# EAGLE design qo-100-lora-transceiver (EAGLE 9.6.1)
CREVISION: 2; DESIGNER: Joao Silva

## Sheet 1 of 3: MCU
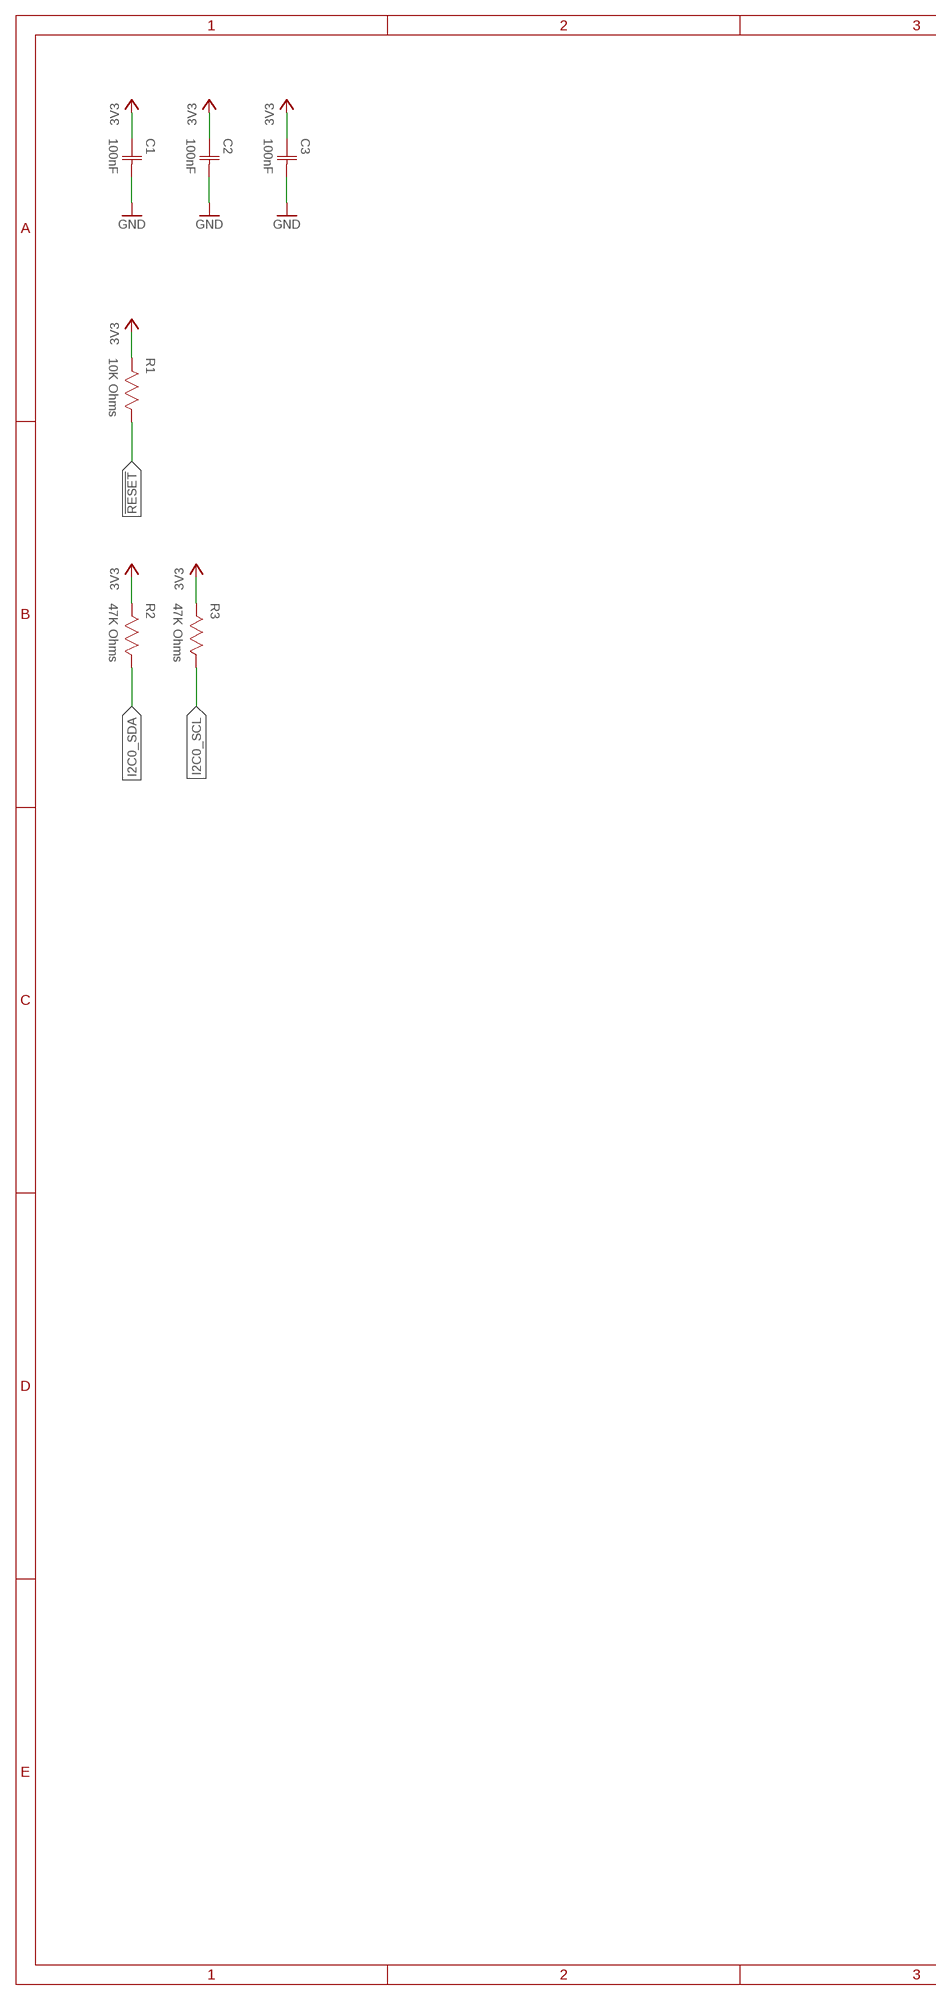
[diagram p0: schematic, sheet 1, part 1 of 2]
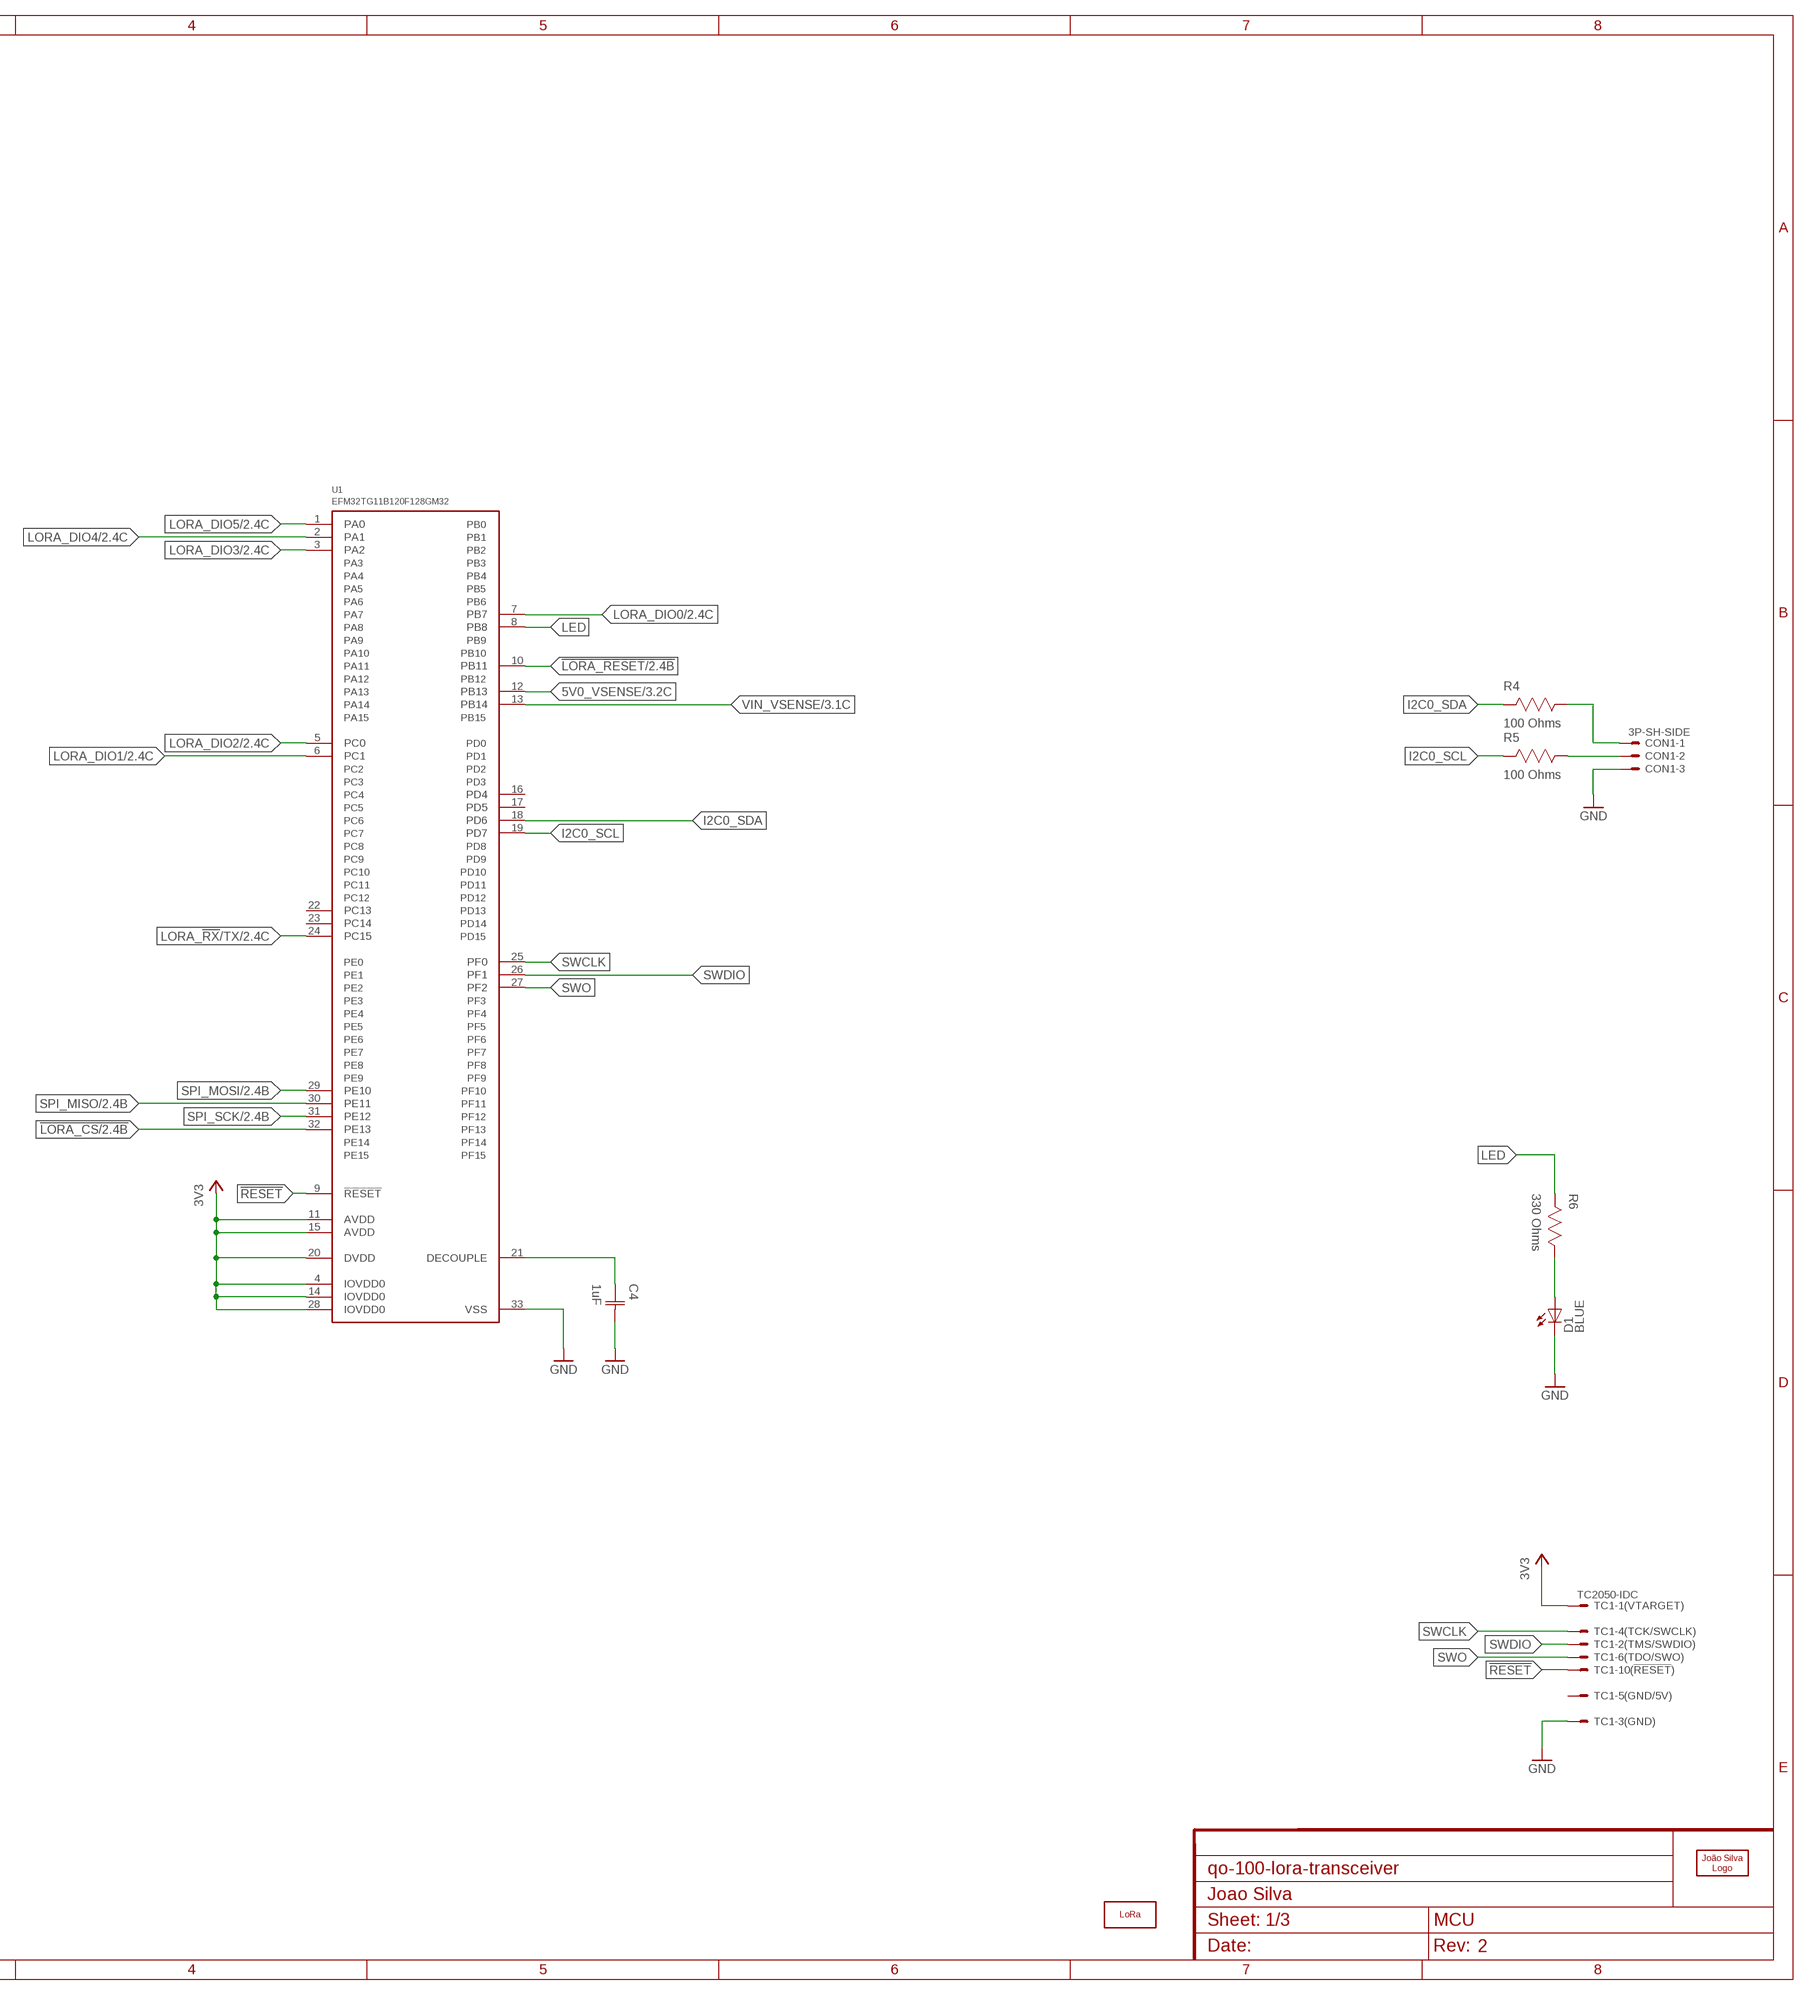
[diagram p1: schematic, sheet 1, part 2 of 2]

### Parts
C1  100nF  CAPACITOR-0603  [CAP0603]
C2  100nF  CAPACITOR-0603  [CAP0603]
C3  100nF  CAPACITOR-0603  [CAP0603]
C4  1uF  CAPACITOR-0603  [CAP0603]
CON1  3P-SH-SIDE  [SH-03-SIDE]
D1  LED0603  [0603]
LOGO1  LORA-10MM  [LORA_10MM]
LOGO2  JS-10MM  [JS_10MM]
R1  10K Ohms  RESISTOR-0603  [RES0603]
R2  47K Ohms  RESISTOR-0603  [RES0603]
R3  47K Ohms  RESISTOR-0603  [RES0603]
R4  100 Ohms  RESISTOR-0603  [RES0603]
R5  100 Ohms  RESISTOR-0603  [RES0603]
R6  330 Ohms  RESISTOR-0603  [RES0603]
TC1  TC2050-IDC  [TC2050-IDC]
U1  EFM32TG11B120F128GM32  [QFN32_0.5P_TG]

### Nets
3V3: C1.1(C1) C2.1(C1) C3.1(C1) R1.2 R2.2 R3.2 TC1.1 U1.4(IOVDD0) U1.11(AVDD) U1.14(IOVDD0) U1.15(AVDD) U1.20(DVDD) U1.28(IOVDD0) ; also sheet 2,3
5V0_VSENSE: U1.12(PB13) ; also sheet 3
!LORA_CS: U1.32(PE13) ; also sheet 2
!LORA_RESET: U1.10(PB11) ; also sheet 2
!RESET: R1.1 TC1.10 U1.9(!RESET)
GND: C1.2(C2) C2.2(C2) C3.2(C2) C4.2(C2) CON1.3 D1.C TC1.3 U1.33(VSS) ; also sheet 2,3
I2C0_SCL: R3.1 R5.2 U1.19(PD7)
I2C0_SDA: R2.1 R4.2 U1.18(PD6)
LED: R6.2 U1.8(PB8)
LORA_!RX!/TX: U1.24(PC15) ; also sheet 2
LORA_DIO0: U1.7(PB7) ; also sheet 2
LORA_DIO1: U1.6(PC1) ; also sheet 2
LORA_DIO2: U1.5(PC0) ; also sheet 2
LORA_DIO3: U1.3(PA2) ; also sheet 2
LORA_DIO4: U1.2(PA1) ; also sheet 2
LORA_DIO5: U1.1(PA0) ; also sheet 2
N$4: CON1.2 R5.1
N$6: C4.1(C1) U1.21(DECOUPLE)
N$25: D1.A R6.1
N$38: CON1.1 R4.1
SPI_MISO: U1.30(PE11) ; also sheet 2
SPI_MOSI: U1.29(PE10) ; also sheet 2
SPI_SCK: U1.31(PE12) ; also sheet 2
SWCLK: TC1.4 U1.25(PF0)
SWDIO: TC1.2 U1.26(PF1)
SWO: TC1.6 U1.27(PF2)
VIN_VSENSE: U1.13(PB14) ; also sheet 3
Unconnected: TC1.5 TC1.7 TC1.8 TC1.9 U1.16(PD4) U1.17(PD5) U1.22(PC13) U1.23(PC14)

## Sheet 2 of 3: LoRa Transceiver
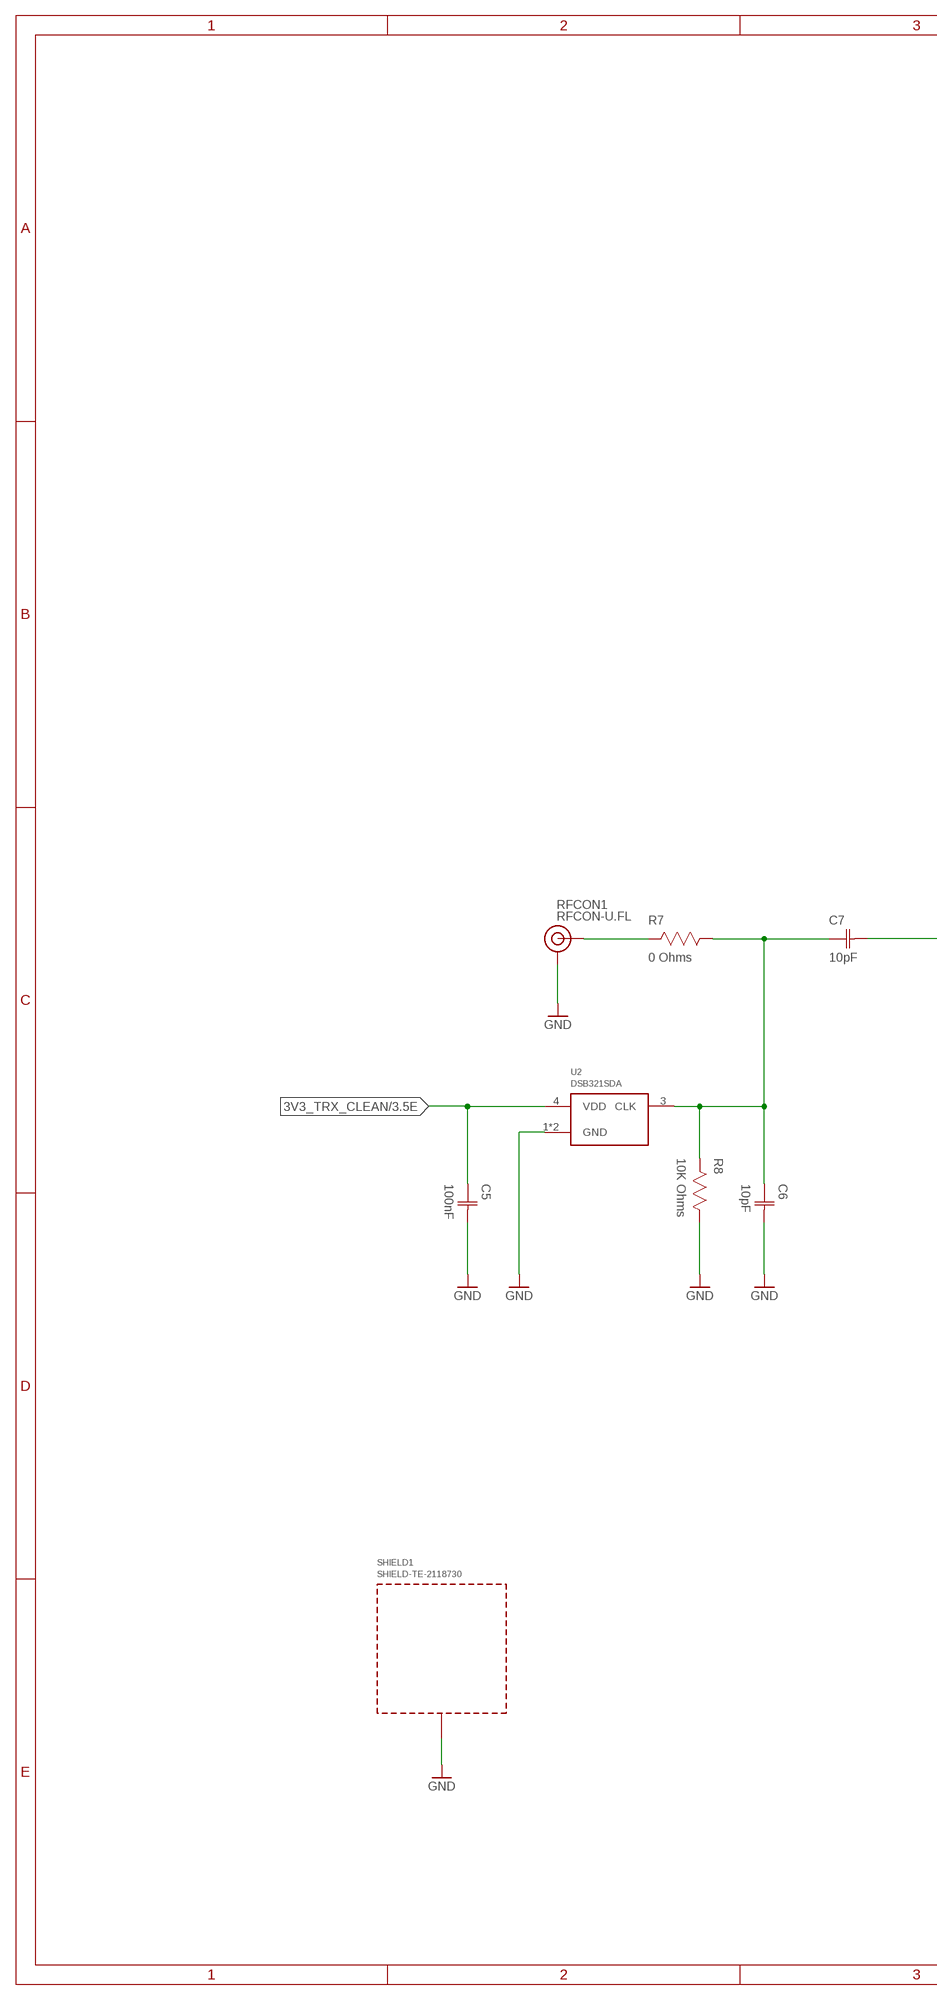
[diagram p2: schematic, sheet 2, part 1 of 2]
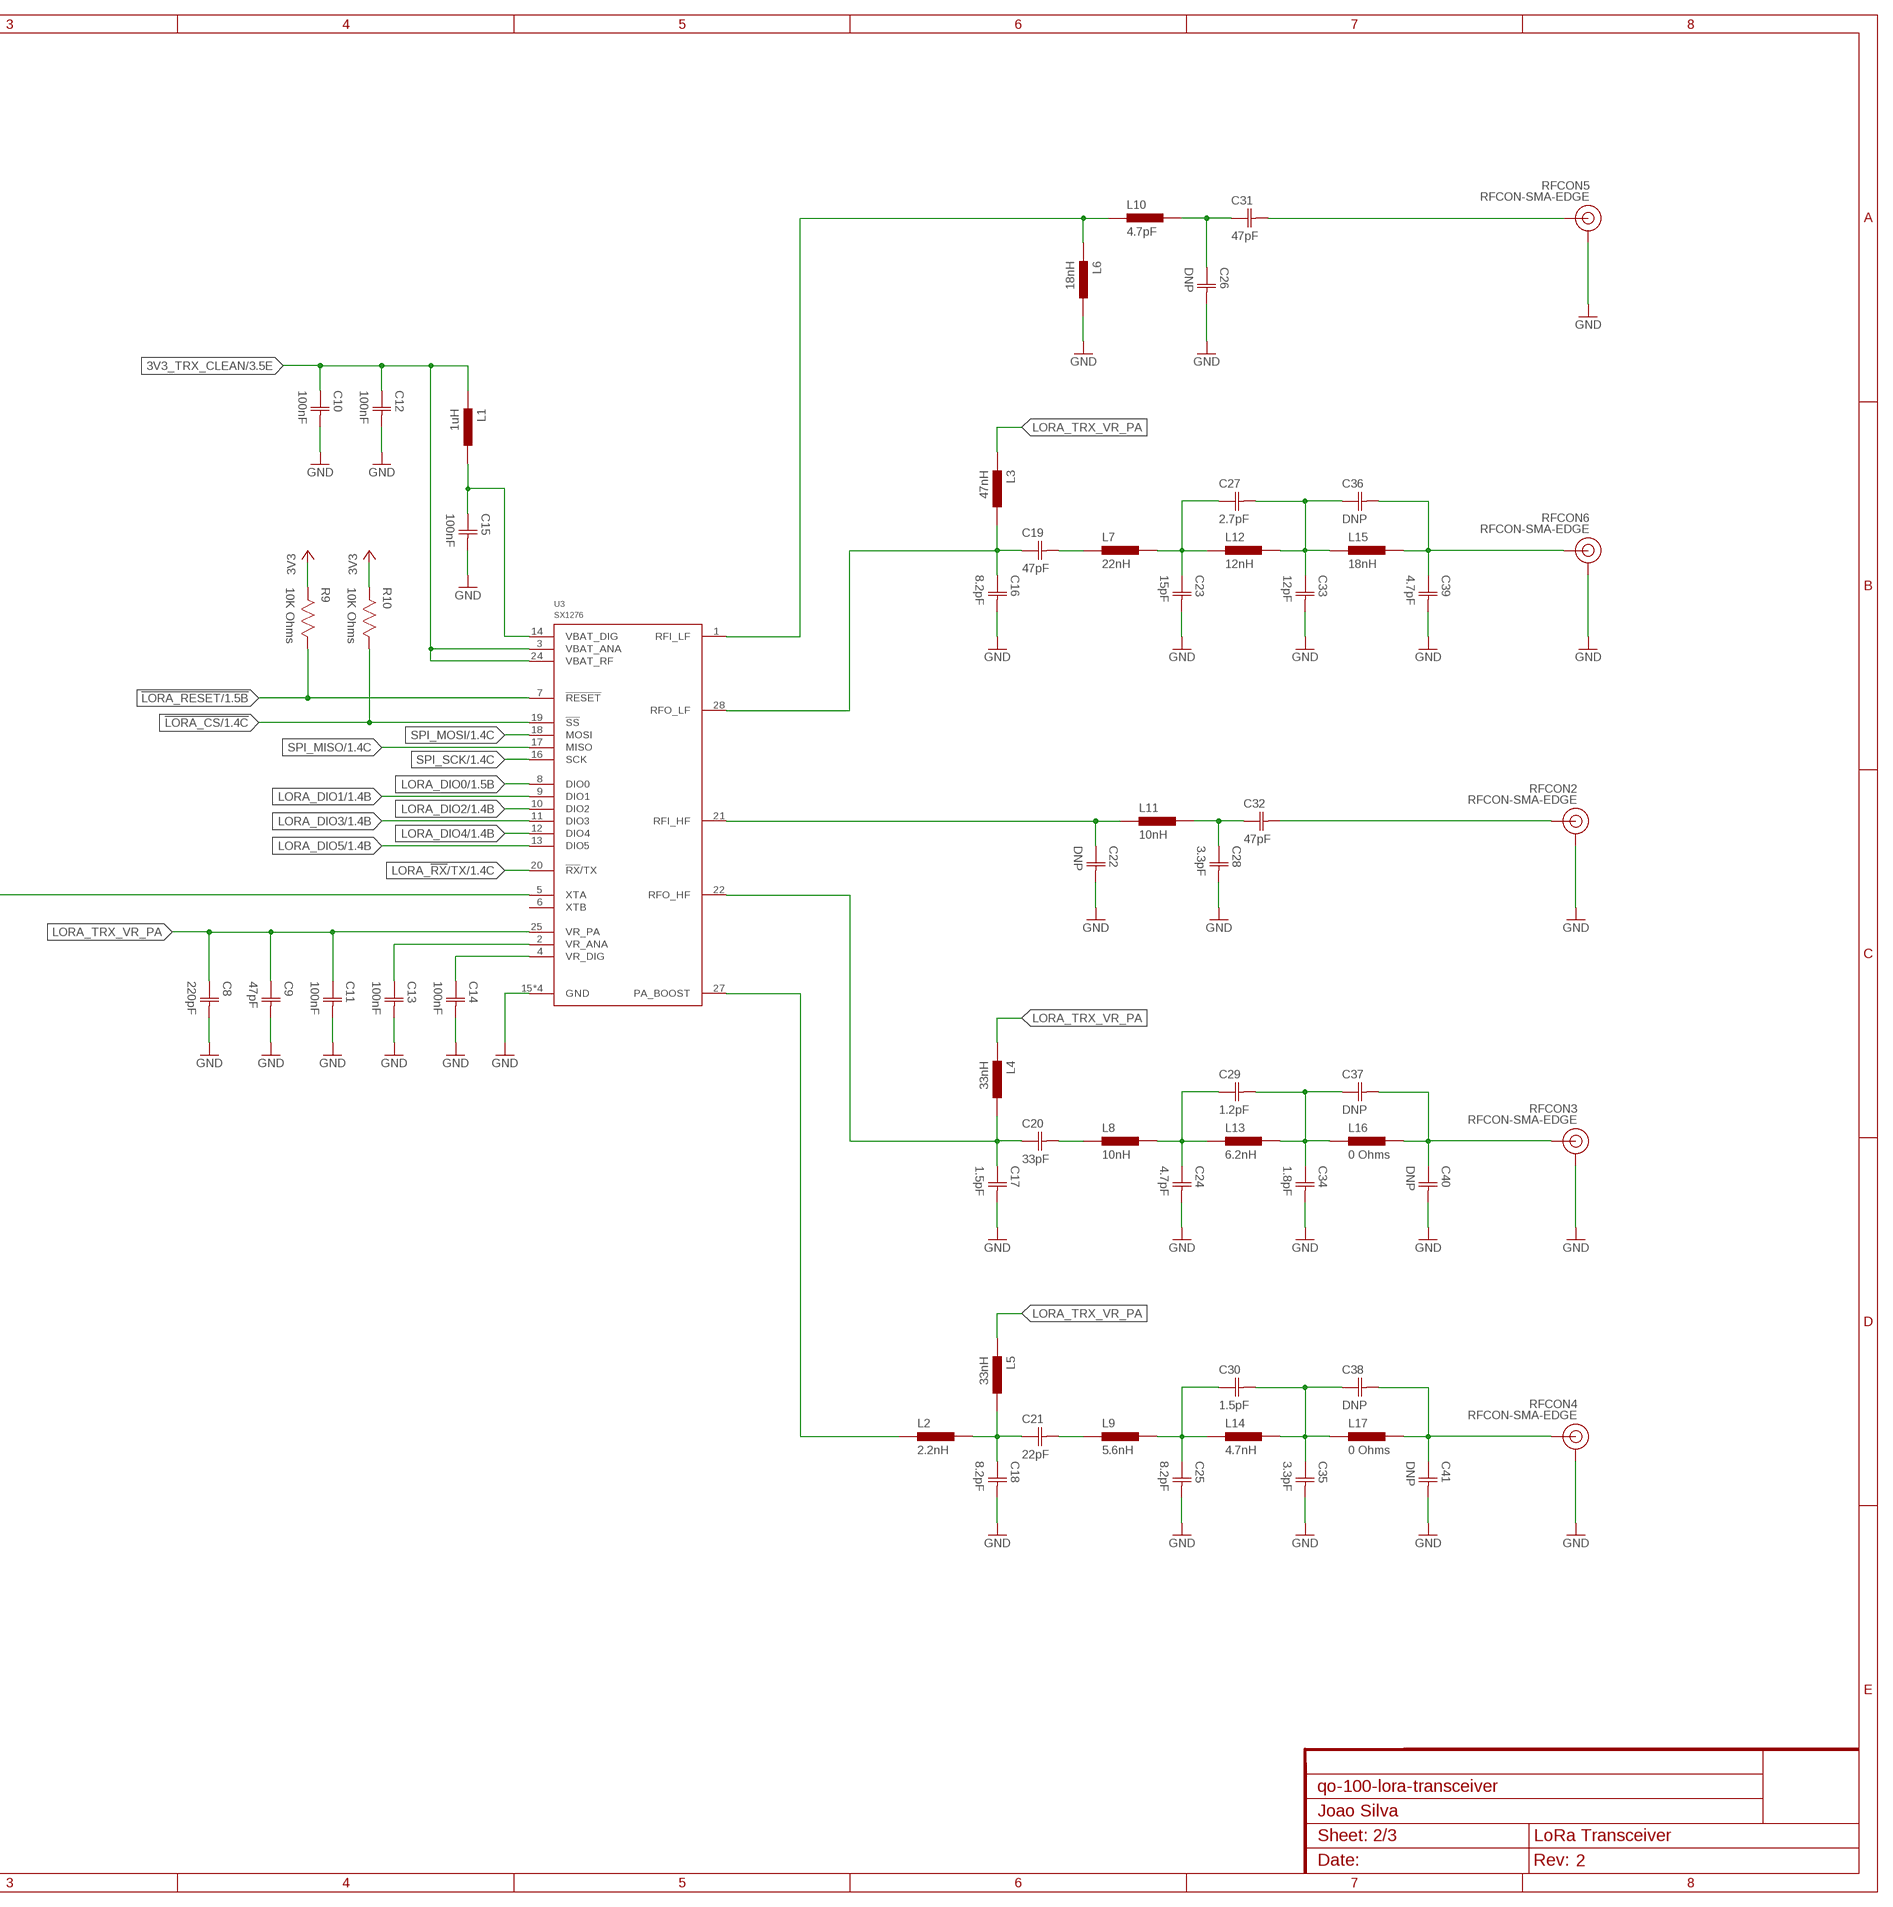
[diagram p3: schematic, sheet 2, part 2 of 2]

### Parts
C5  100nF  CAPACITOR-0603  [CAP0603]
C6  10pF  CAPACITOR-0603  [CAP0603]
C7  10pF  CAPACITOR-0603  [CAP0603]
C8  220pF  CAPACITOR-0603  [CAP0603]
C9  47pF  CAPACITOR-0603  [CAP0603]
C10  100nF  CAPACITOR-0603  [CAP0603]
C11  100nF  CAPACITOR-0603  [CAP0603]
C12  100nF  CAPACITOR-0603  [CAP0603]
C13  100nF  CAPACITOR-0603  [CAP0603]
C14  100nF  CAPACITOR-0603  [CAP0603]
C15  100nF  CAPACITOR-0603  [CAP0603]
C16  8.2pF  CAPACITOR-0603  [CAP0603]
C17  1.5pF  CAPACITOR-0603  [CAP0603]
C18  8.2pF  CAPACITOR-0603  [CAP0603]
C19  47pF  CAPACITOR-0603  [CAP0603]
C20  33pF  CAPACITOR-0603  [CAP0603]
C21  22pF  CAPACITOR-0603  [CAP0603]
C22  DNP  CAPACITOR-0603  [CAP0603]
C23  15pF  CAPACITOR-0603  [CAP0603]
C24  4.7pF  CAPACITOR-0603  [CAP0603]
C25  8.2pF  CAPACITOR-0603  [CAP0603]
C26  DNP  CAPACITOR-0603  [CAP0603]
C27  2.7pF  CAPACITOR-0603  [CAP0603]
C28  3.3pF  CAPACITOR-0603  [CAP0603]
C29  1.2pF  CAPACITOR-0603  [CAP0603]
C30  1.5pF  CAPACITOR-0603  [CAP0603]
C31  47pF  CAPACITOR-0603  [CAP0603]
C32  47pF  CAPACITOR-0603  [CAP0603]
C33  12pF  CAPACITOR-0603  [CAP0603]
C34  1.8pF  CAPACITOR-0603  [CAP0603]
C35  3.3pF  CAPACITOR-0603  [CAP0603]
C36  DNP  CAPACITOR-0603  [CAP0603]
C37  DNP  CAPACITOR-0603  [CAP0603]
C38  DNP  CAPACITOR-0603  [CAP0603]
C39  4.7pF  CAPACITOR-0603  [CAP0603]
C40  DNP  CAPACITOR-0603  [CAP0603]
C41  DNP  CAPACITOR-0603  [CAP0603]
L1  1uH  INDUCTOR-0603  [IND0603]
L2  2.2nH  INDUCTOR-0603  [IND0603]
L3  47nH  INDUCTOR-0603  [IND0603]
L4  33nH  INDUCTOR-0603  [IND0603]
L5  33nH  INDUCTOR-0603  [IND0603]
L6  18nH  INDUCTOR-0603  [IND0603]
L7  22nH  INDUCTOR-0603  [IND0603]
L8  10nH  INDUCTOR-0603  [IND0603]
L9  5.6nH  INDUCTOR-0603  [IND0603]
L10  4.7pF  INDUCTOR-0603  [IND0603]
L11  10nH  INDUCTOR-0603  [IND0603]
L12  12nH  INDUCTOR-0603  [IND0603]
L13  6.2nH  INDUCTOR-0603  [IND0603]
L14  4.7nH  INDUCTOR-0603  [IND0603]
L15  18nH  INDUCTOR-0603  [IND0603]
L16  0 Ohms  INDUCTOR-0603  [IND0603]
L17  0 Ohms  INDUCTOR-0603  [IND0603]
R7  0 Ohms  RESISTOR-0603  [RES0603]
R8  10K Ohms  RESISTOR-0603  [RES0603]
R9  10K Ohms  RESISTOR-0603  [RES0603]
R10  10K Ohms  RESISTOR-0603  [RES0603]
RFCON1  RFCON-U.FL  [U.FL]
RFCON2  RFCON-SMA-EDGE  [SMA-EDGE]
RFCON3  RFCON-SMA-EDGE  [SMA-EDGE]
RFCON4  RFCON-SMA-EDGE  [SMA-EDGE]
RFCON5  RFCON-SMA-EDGE  [SMA-EDGE]
RFCON6  RFCON-SMA-EDGE  [SMA-EDGE]
SHIELD1  SHIELD-TE-2118730  [2118730]
U2  DSB321SDA  [TCXO-3225]
U3  SX1276  [QFN28]

### Nets
3V3: R9.2 R10.2 ; also sheet 1,3
3V3_TRX_CLEAN: C5.1(C1) C10.1(C1) C12.1(C1) L1.1 U2.4(VDD) U3.3(VBAT_ANA) U3.24(VBAT_RF) ; also sheet 3
!LORA_CS: R10.1 U3.19(!SS) ; also sheet 1
!LORA_RESET: R9.1 U3.7(!RESET) ; also sheet 1
GND: C5.2(C2) C6.2(C2) C8.2(C2) C9.2(C2) C10.2(C2) C11.2(C2) C12.2(C2) C13.2(C2) C14.2(C2) C15.2(C2) C16.2(C2) C17.2(C2) C18.2(C2) C22.2(C2) C23.2(C2) C24.2(C2) C25.2(C2) C26.2(C2) C28.2(C2) C33.2(C2) C34.2(C2) C35.2(C2) C39.2(C2) C40.2(C2) C41.2(C2) L6.2 R8.1 RFCON1.P$1(GND) RFCON1.P$2(GND) RFCON2.GND@0(GND) RFCON2.GND@1(GND) RFCON2.GND@2(GND) RFCON2.GND@3(GND) RFCON3.GND@0(GND) RFCON3.GND@1(GND) RFCON3.GND@2(GND) RFCON3.GND@3(GND) RFCON4.GND@0(GND) RFCON4.GND@1(GND) RFCON4.GND@2(GND) RFCON4.GND@3(GND) RFCON5.GND@0(GND) RFCON5.GND@1(GND) RFCON5.GND@2(GND) RFCON5.GND@3(GND) RFCON6.GND@0(GND) RFCON6.GND@1(GND) RFCON6.GND@2(GND) RFCON6.GND@3(GND) SHIELD1.1(GND) SHIELD1.2(GND) SHIELD1.3(GND) SHIELD1.4(GND) SHIELD1.5(GND) SHIELD1.6(GND) SHIELD1.7(GND) SHIELD1.8(GND) SHIELD1.9(GND) SHIELD1.10(GND) SHIELD1.11(GND) SHIELD1.12(GND) SHIELD1.13(GND) SHIELD1.14(GND) SHIELD1.15(GND) SHIELD1.16(GND) SHIELD1.17(GND) SHIELD1.18(GND) SHIELD1.19(GND) SHIELD1.20(GND) SHIELD1.21(GND) SHIELD1.22(GND) SHIELD1.23(GND) SHIELD1.24(GND) SHIELD1.25(GND) SHIELD1.26(GND) SHIELD1.27(GND) SHIELD1.28(GND) U2.1(GND) U2.2(GND) U3.15(GND) U3.23(GND) U3.26(GND) U3.29(GND) ; also sheet 1,3
LORA_!RX!/TX: U3.20(!RX!/TX) ; also sheet 1
LORA_DIO0: U3.8(DIO0) ; also sheet 1
LORA_DIO1: U3.9(DIO1) ; also sheet 1
LORA_DIO2: U3.10(DIO2) ; also sheet 1
LORA_DIO3: U3.11(DIO3) ; also sheet 1
LORA_DIO4: U3.12(DIO4) ; also sheet 1
LORA_DIO5: U3.13(DIO5) ; also sheet 1
LORA_TRX_VR_ANA: C13.1(C1) U3.2(VR_ANA)
LORA_TRX_VR_DIG: C14.1(C1) U3.4(VR_DIG)
LORA_TRX_VR_PA: C8.1(C1) C9.1(C1) C11.1(C1) L3.1 L4.1 L5.1 U3.25(VR_PA)
N$1: C15.1(C1) L1.2 U3.14(VBAT_DIG)
N$2: C16.1(C1) C19.1(C1) L3.2 U3.28(RFO_LF)
N$3: C19.2(C2) L7.1
N$5: C23.1(C1) C27.1(C1) L7.2 L12.1
N$7: C27.2(C2) C33.1(C1) C36.1(C1) L12.2 L15.1
N$8: C22.1(C1) L11.1 U3.21(RFI_HF)
N$9: L6.1 L10.1 U3.1(RFI_LF)
N$10: C26.1(C1) C31.1(C1) L10.2
N$11: C17.1(C1) C20.1(C1) L4.2 U3.22(RFO_HF)
N$12: C20.2(C2) L8.1
N$13: C24.1(C1) C29.1(C1) L8.2 L13.1
N$14: C29.2(C2) C34.1(C1) C37.1(C1) L13.2 L16.1
N$15: C37.2(C2) C40.1(C1) L16.2 RFCON3.SIG(SIGNAL)
N$16: C28.1(C1) C32.1(C1) L11.2
N$17: L2.1 U3.27(PA_BOOST)
N$18: C18.1(C1) C21.1(C1) L2.2 L5.2
N$20: C36.2(C2) C39.1(C1) L15.2 RFCON6.SIG(SIGNAL)
N$21: C21.2(C2) L9.1
N$22: C25.1(C1) C30.1(C1) L9.2 L14.1
N$23: C30.2(C2) C35.1(C1) C38.1(C1) L14.2 L17.1
N$24: C38.2(C2) C41.1(C1) L17.2 RFCON4.SIG(SIGNAL)
N$26: C31.2(C2) RFCON5.SIG(SIGNAL)
N$27: C32.2(C2) RFCON2.SIG(SIGNAL)
N$28: C7.2(C2) U3.5(XTA)
N$29: R7.2 RFCON1.P$3(SIGNAL)
PLL_REF_DCC: C6.1(C1) C7.1(C1) R7.1 R8.2 U2.3(CLK)
SPI_MISO: U3.17(MISO) ; also sheet 1
SPI_MOSI: U3.18(MOSI) ; also sheet 1
SPI_SCK: U3.16(SCK) ; also sheet 1
Unconnected: U3.6(XTB)

## Sheet 3 of 3: Power
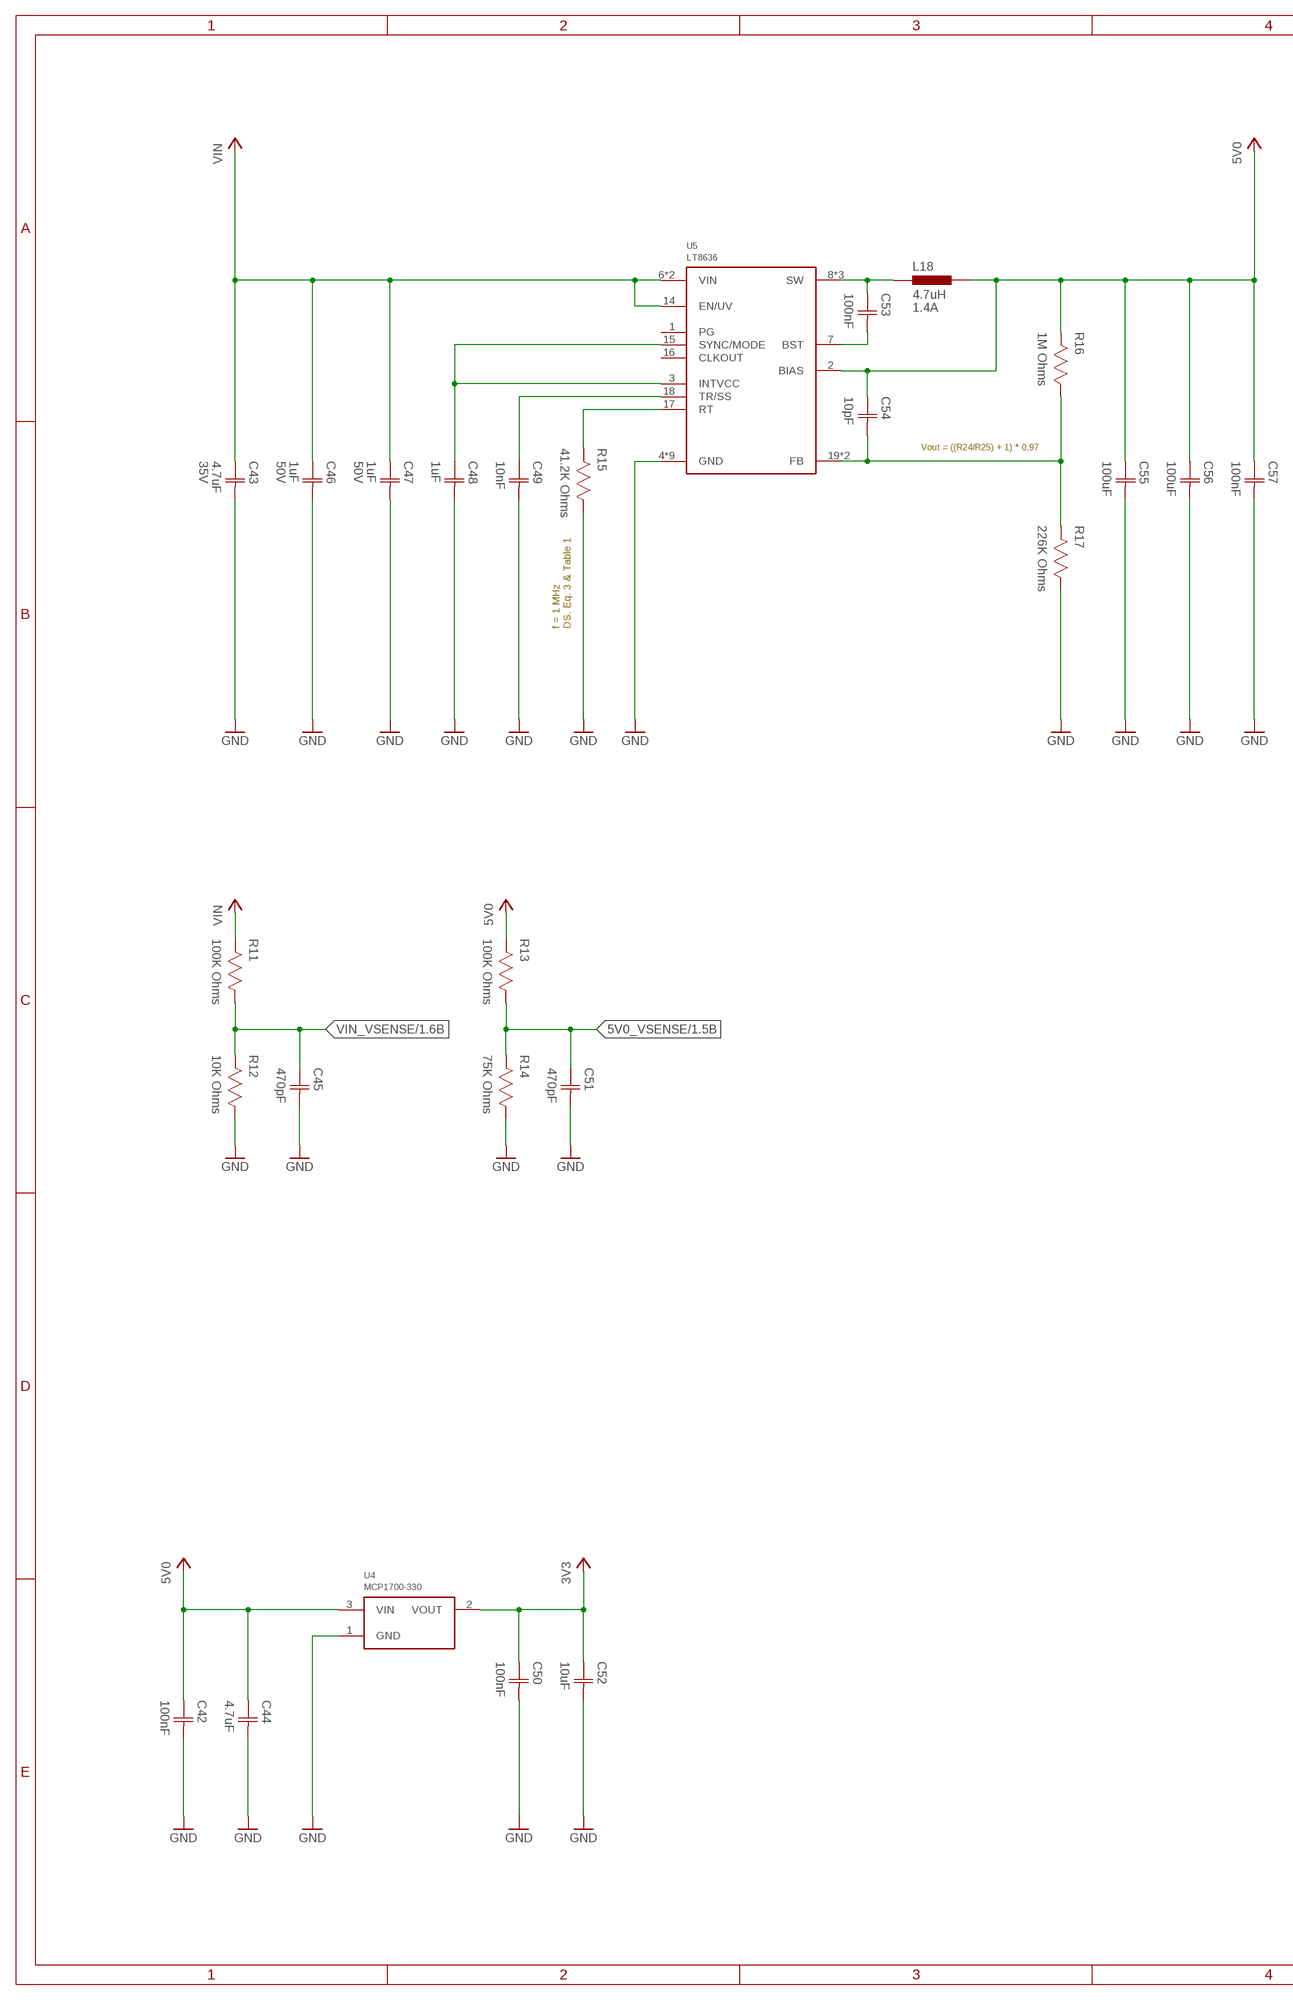
[diagram p4: schematic, sheet 3, part 1 of 2]
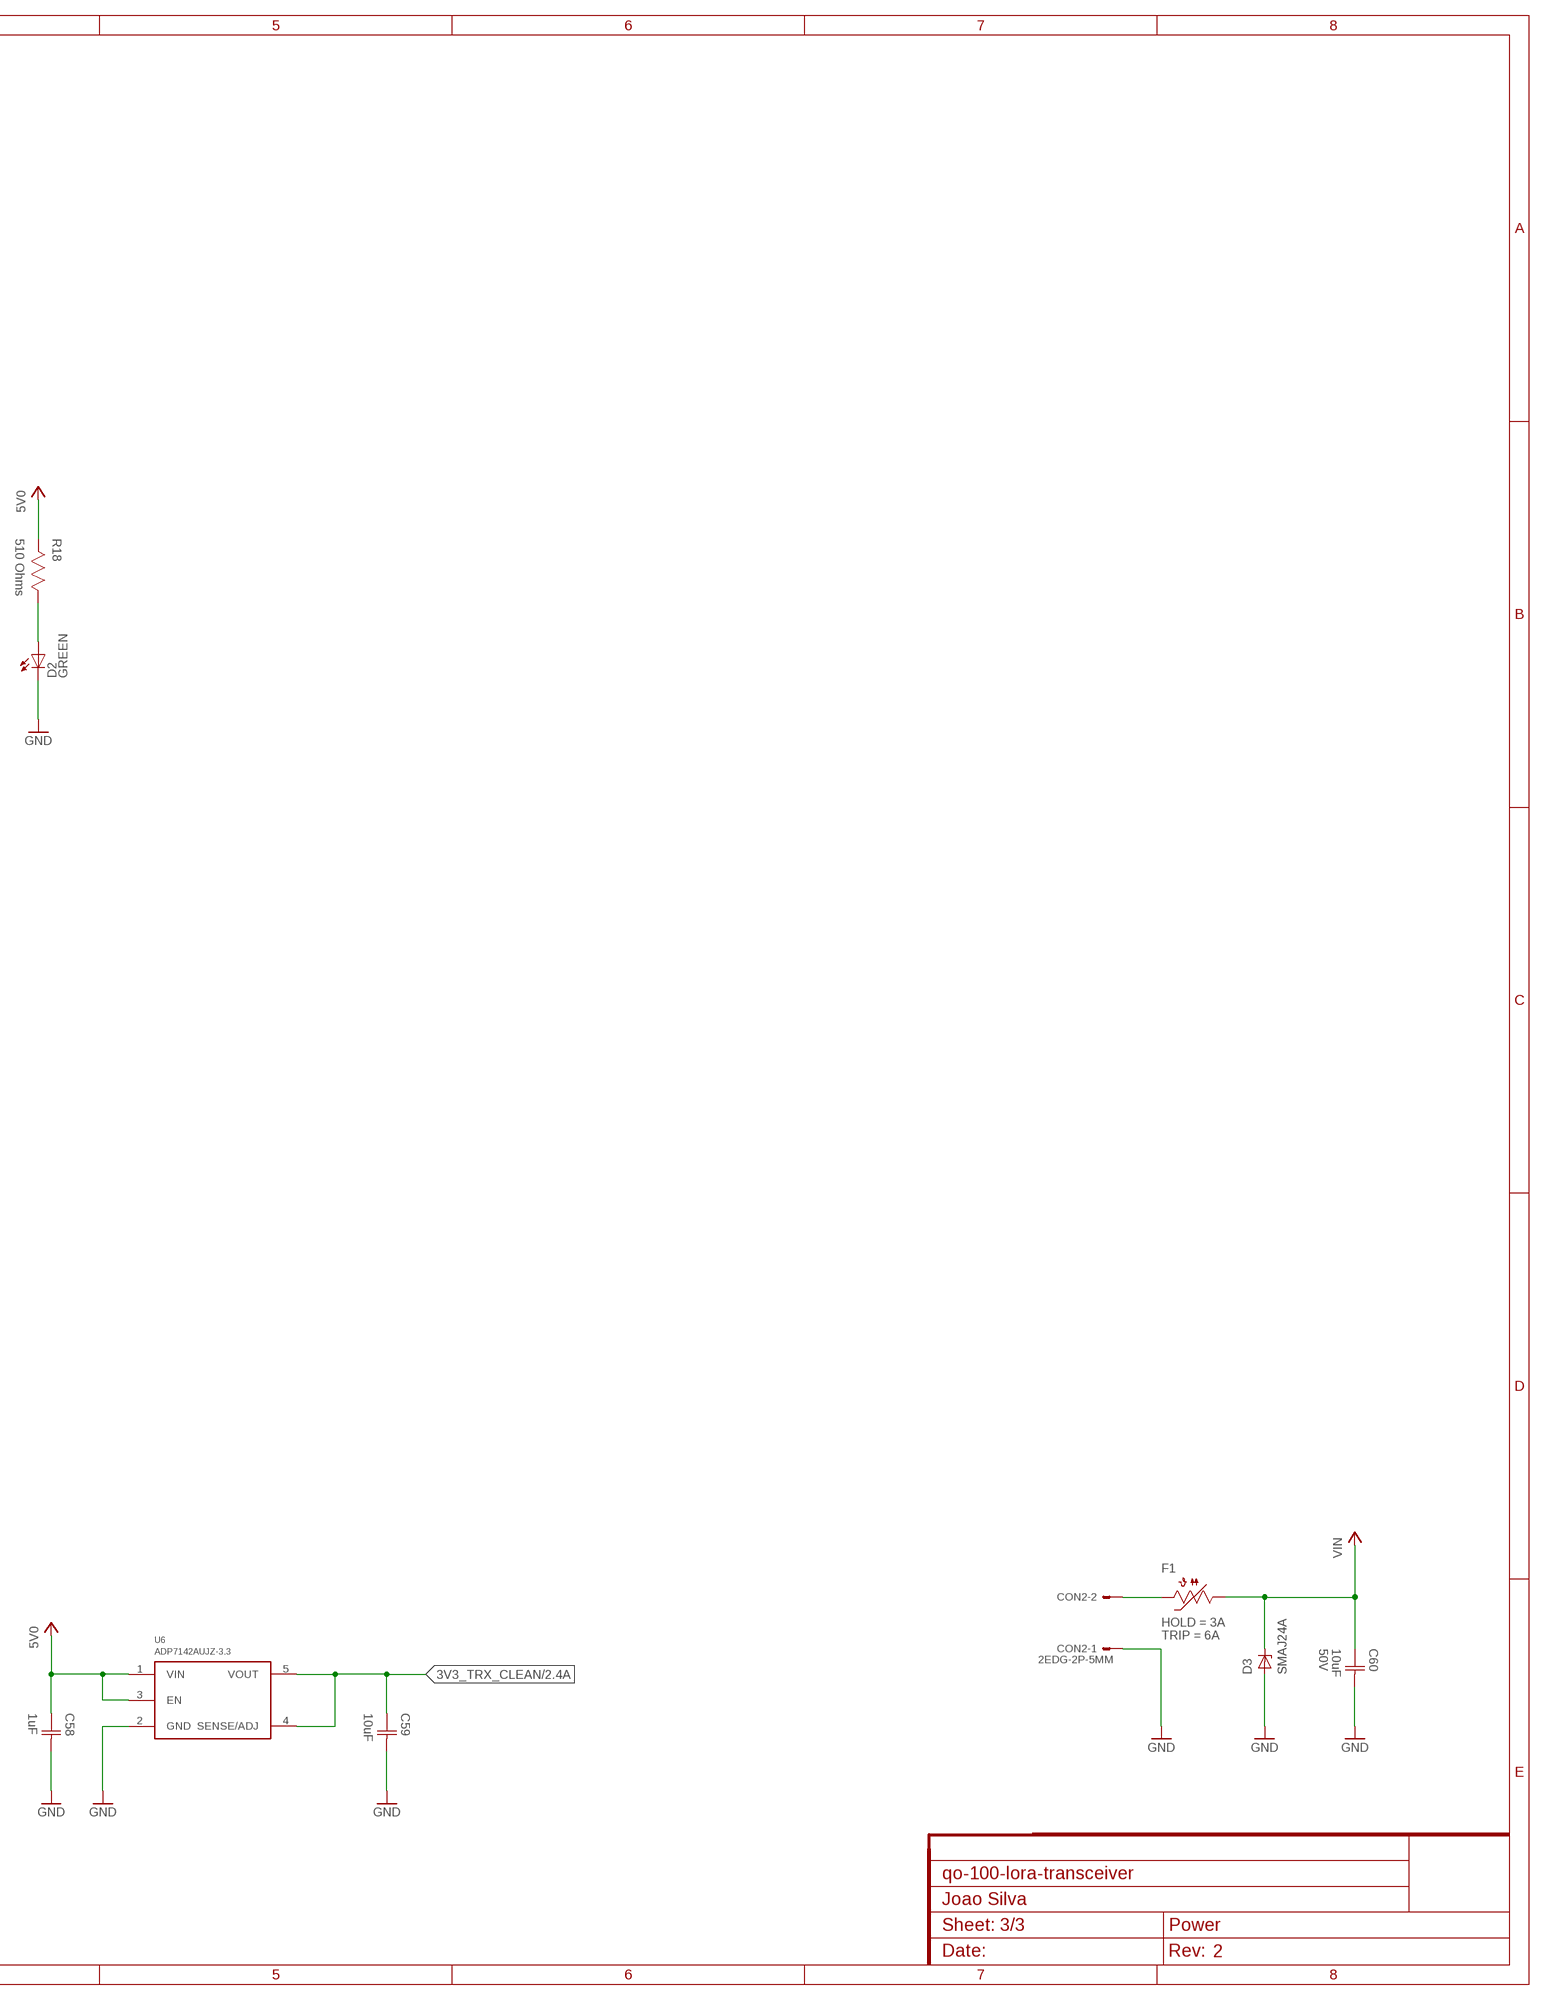
[diagram p5: schematic, sheet 3, part 2 of 2]

### Parts
C42  100nF  CAPACITOR-0603  [CAP0603]
C43  4.7uF  CAPACITOR-0603  [CAP0603]
C44  4.7uF  CAPACITOR-0603  [CAP0603]
C45  470pF  CAPACITOR-0603  [CAP0603]
C46  1uF  CAPACITOR-0603  [CAP0603]
C47  1uF  CAPACITOR-0603  [CAP0603]
C48  1uF  CAPACITOR-0603  [CAP0603]
C49  10nF  CAPACITOR-0603  [CAP0603]
C50  100nF  CAPACITOR-0603  [CAP0603]
C51  470pF  CAPACITOR-0603  [CAP0603]
C52  10uF  CAPACITOR-0603  [CAP0603]
C53  100nF  CAPACITOR-0603  [CAP0603]
C54  10pF  CAPACITOR-0603  [CAP0603]
C55  100uF  CAPACITOR-1206  [CAP1206]
C56  100uF  CAPACITOR-1206  [CAP1206]
C57  100nF  CAPACITOR-0603  [CAP0603]
C58  1uF  CAPACITOR-0603  [CAP0603]
C59  10uF  CAPACITOR-0603  [CAP0603]
C60  10uF  CAPACITOR-1206  [CAP1206]
CON2  2EDG-2P-5MM  [2EDG-2P-5MM]
D2  LED0603  [0603]
D3  SMAJ24A  [DO214AC]
F1  2.6A Hold  PTC1206  [1206]
L18  4.7uH  INDUCTOR-2.5X2X1.2MM  [IND2520]
R11  100K Ohms  RESISTOR-0603  [RES0603]
R12  10K Ohms  RESISTOR-0603  [RES0603]
R13  100K Ohms  RESISTOR-0603  [RES0603]
R14  75K Ohms  RESISTOR-0603  [RES0603]
R15  41.2K Ohms  RESISTOR-0603  [RES0603]
R16  1M Ohms  RESISTOR-0603  [RES0603]
R17  226K Ohms  RESISTOR-0603  [RES0603]
R18  510 Ohms  RESISTOR-0603  [RES0603]
U4  MCP1700-330  [SOT23]
U5  LT8636  [QFN20_ASYM_CORNER]
U6  ADP7142AUJZ-3.3  [SOT23-5]

### Nets
3V3: C50.1(C1) C52.1(C1) U4.2(VOUT) ; also sheet 1,2
3V3_TRX_CLEAN: C59.1(C1) U6.4(SENSE/ADJ) U6.5(VOUT) ; also sheet 2
5V0: C42.1(C1) C44.1(C1) C54.1(C1) C55.1(C1) C56.1(C1) C57.1(C1) C58.1(C1) L18.2 R13.2 R16.2 R18.2 U4.3(VIN) U5.2(BIAS) U6.1(VIN) U6.3(EN)
5V0_BST: C53.2(C2) U5.7(BST)
5V0_FB: C54.2(C2) R16.1 R17.2 U5.19(FB) U5.20(FB)
5V0_INTVCC: C48.1(C1) U5.3(INTVCC) U5.15(SYNC/MODE)
5V0_RT: R15.2 U5.17(RT)
5V0_SS: C49.1(C1) U5.18(TR/SS)
5V0_SW: C53.1(C1) L18.1 U5.8(SW) U5.9(SW) U5.10(SW)
5V0_VSENSE: C51.1(C1) R13.1 R14.2 ; also sheet 1
GND: C42.2(C2) C43.2(C2) C44.2(C2) C45.2(C2) C46.2(C2) C47.2(C2) C48.2(C2) C49.2(C2) C50.2(C2) C51.2(C2) C52.2(C2) C55.2(C2) C56.2(C2) C57.2(C2) C58.2(C2) C59.2(C2) C60.2(C2) CON2.P$1 D2.C D3.A R12.1 R14.1 R15.1 R17.1 U4.1(GND) U5.4(GND) U5.5(GND) U5.12(GND) U5.13(GND) U5.21(GND) U5.M1(GND) U5.M2(GND) U5.M3(GND) U5.M4(GND) U6.2(GND) ; also sheet 1,2
N$19: CON2.P$2 F1.2
N$149: D2.A R18.1
VIN: C43.1(C1) C46.1(C1) C47.1(C1) C60.1(C1) D3.C F1.1 R11.2 U5.6(VIN) U5.11(VIN) U5.14(EN/UV)
VIN_VSENSE: C45.1(C1) R11.1 R12.2 ; also sheet 1
Unconnected: U5.1(PG) U5.16(CLKOUT)

### Notes on the sheet
- Vout = ((R24/R25) + 1) * 0.97
- f = 1 MHz
  DS. Eq. 3 & Table 1

## Library data of the parts
C1-C42 C44 C45 C48-C59 = Capacitor:CAPACITOR
C43 = Capacitor:CAPACITOR; VOLTAGE: 35V
C46 C47 C60 = Capacitor:CAPACITOR; VOLTAGE: 50V
CON1 = JST:3P: Disconnectable Crimp style connector, 1.0mm pitch 3 contacts
CON2 = Generic Connector:2EDG-2P
D1 = LED:LED; COLOR: BLUE
D2 = LED:LED; COLOR: GREEN
D3 = TVS:SMAJ*A: SMAJ Series TVS Diodes Source: http://www.littelfuse.com/~/media/electronics/datasheets/tvs_diodes/littelfuse_tvs_diode_smaj_datasheet.pdf.pdf; MF: Littelfuse; MPN: SMAJ24A; OC_FARNELL: 1886345; OC_NEWARK: 06R1865
F1 = PTC Fuses:PTC; HOLD: 3A; OCLCSC: C207041; TRIP: 6A
L1-L17 = Inductor:INDUCTOR
L18 = Inductor:INDUCTOR; CURRENT: 1.4A; OCLCSC: C443497
LOGO1 = Silkscreen:LORA
LOGO2 = Silkscreen:JS
R1-R18 = Resistor:RESISTOR
RFCON1-RFCON6 = RF Connector:RFCON
SHIELD1 = Shield:SHIELD
TC1 = TagConnect:TC2050-IDC
U1 = EFM32:EFM32TG11B1*M32
U2 = Crystal:DSB321SDA
U3 = Semtech:SX127*
U4 = Microchip:MCP1700-*
U5 = Analog Devices:LT8636
U6 = Analog Devices:ADP7142AUJZ*

## Net classes
1 75 Ohm: width 0.5 mm, clearance 0.3 mm

## Board
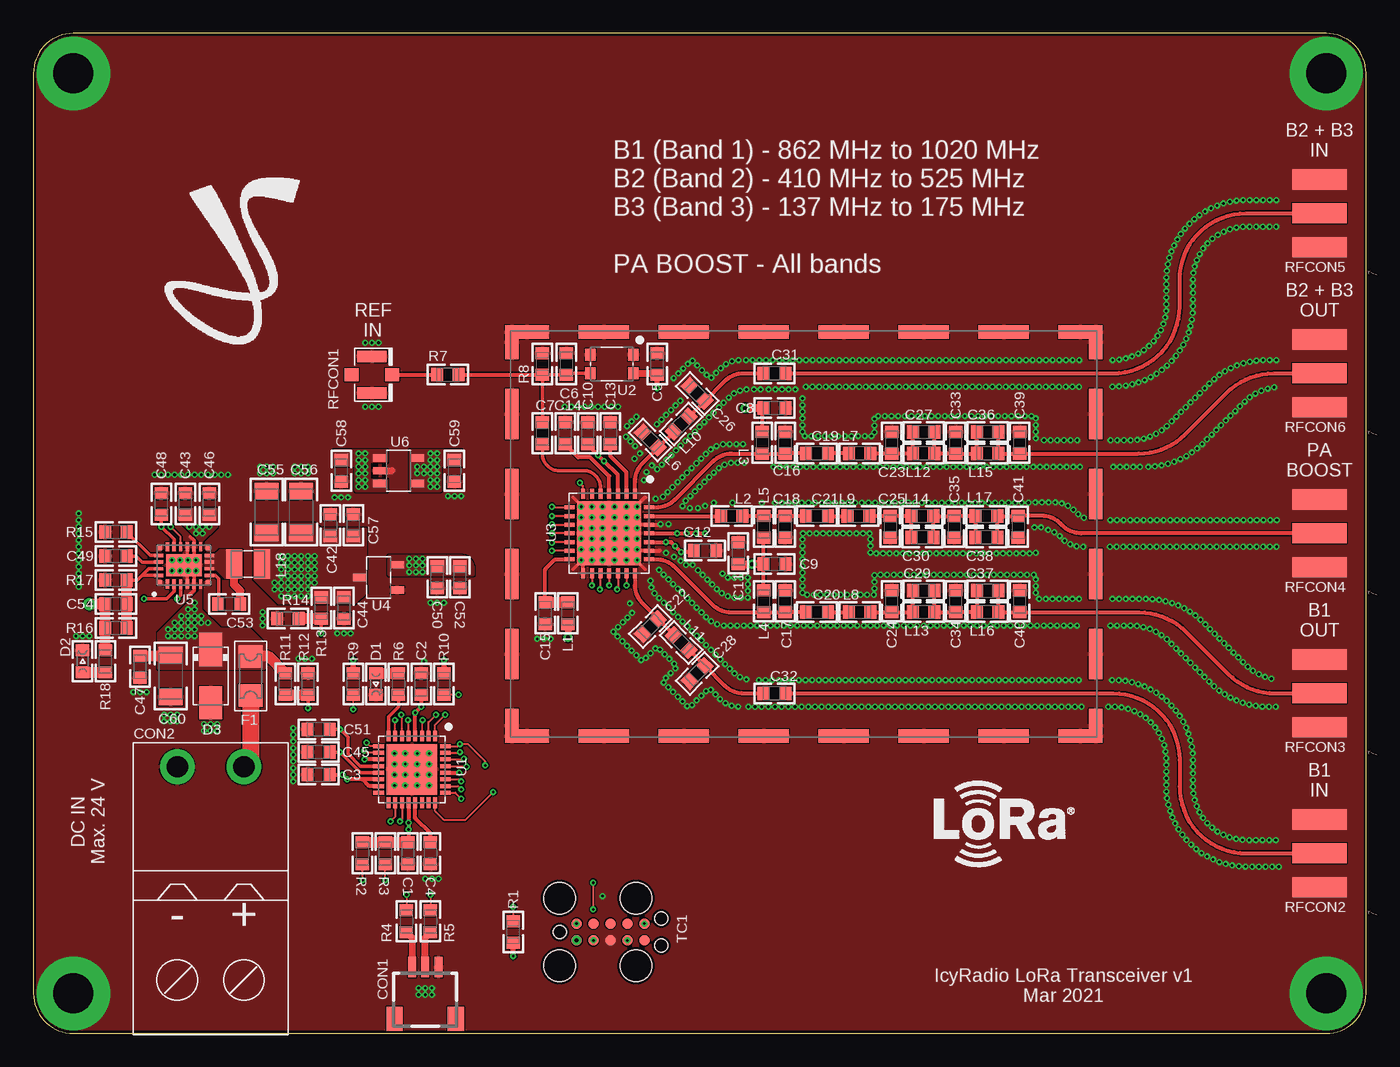
[diagram p6: board, top side]
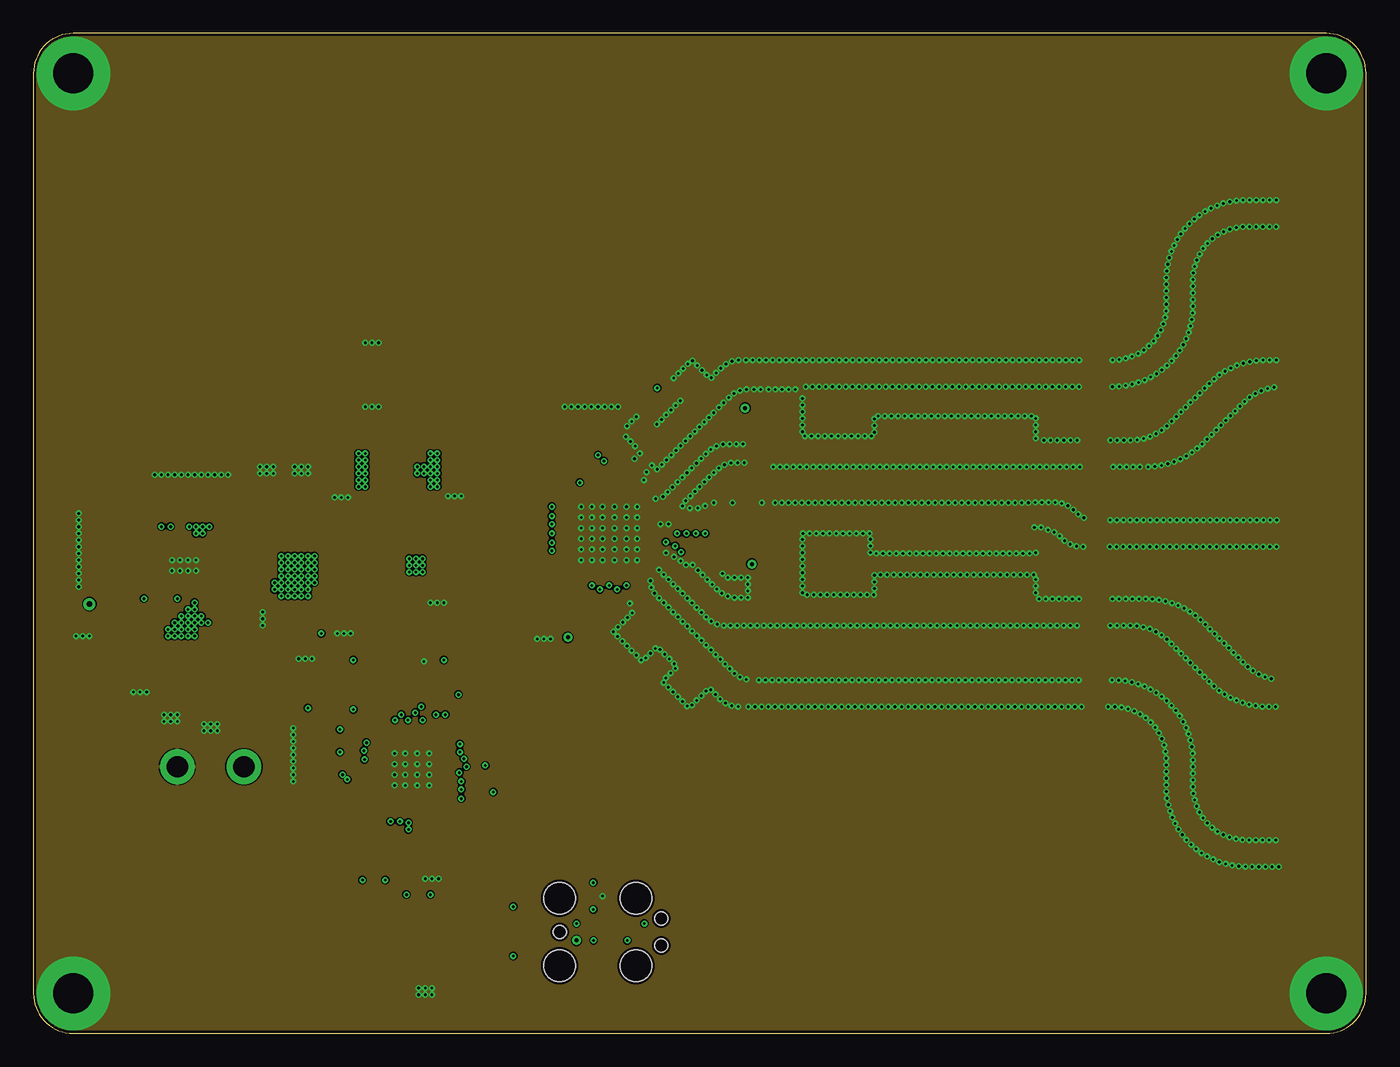
[diagram p7: board, inner layer Route2]
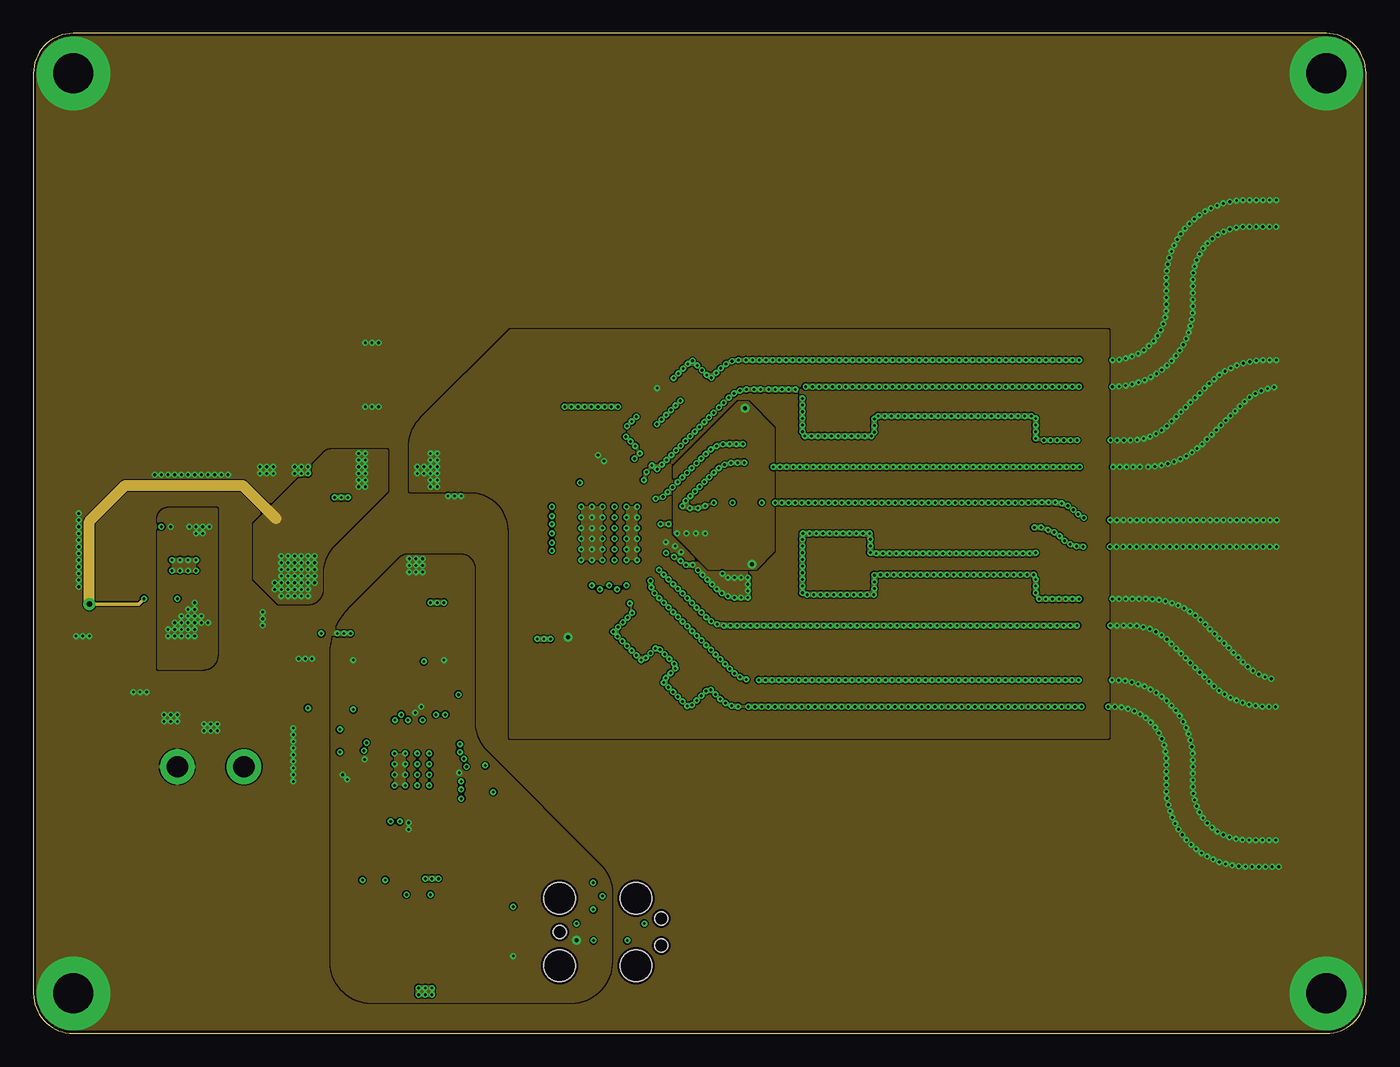
[diagram p8: board, inner layer Route15]
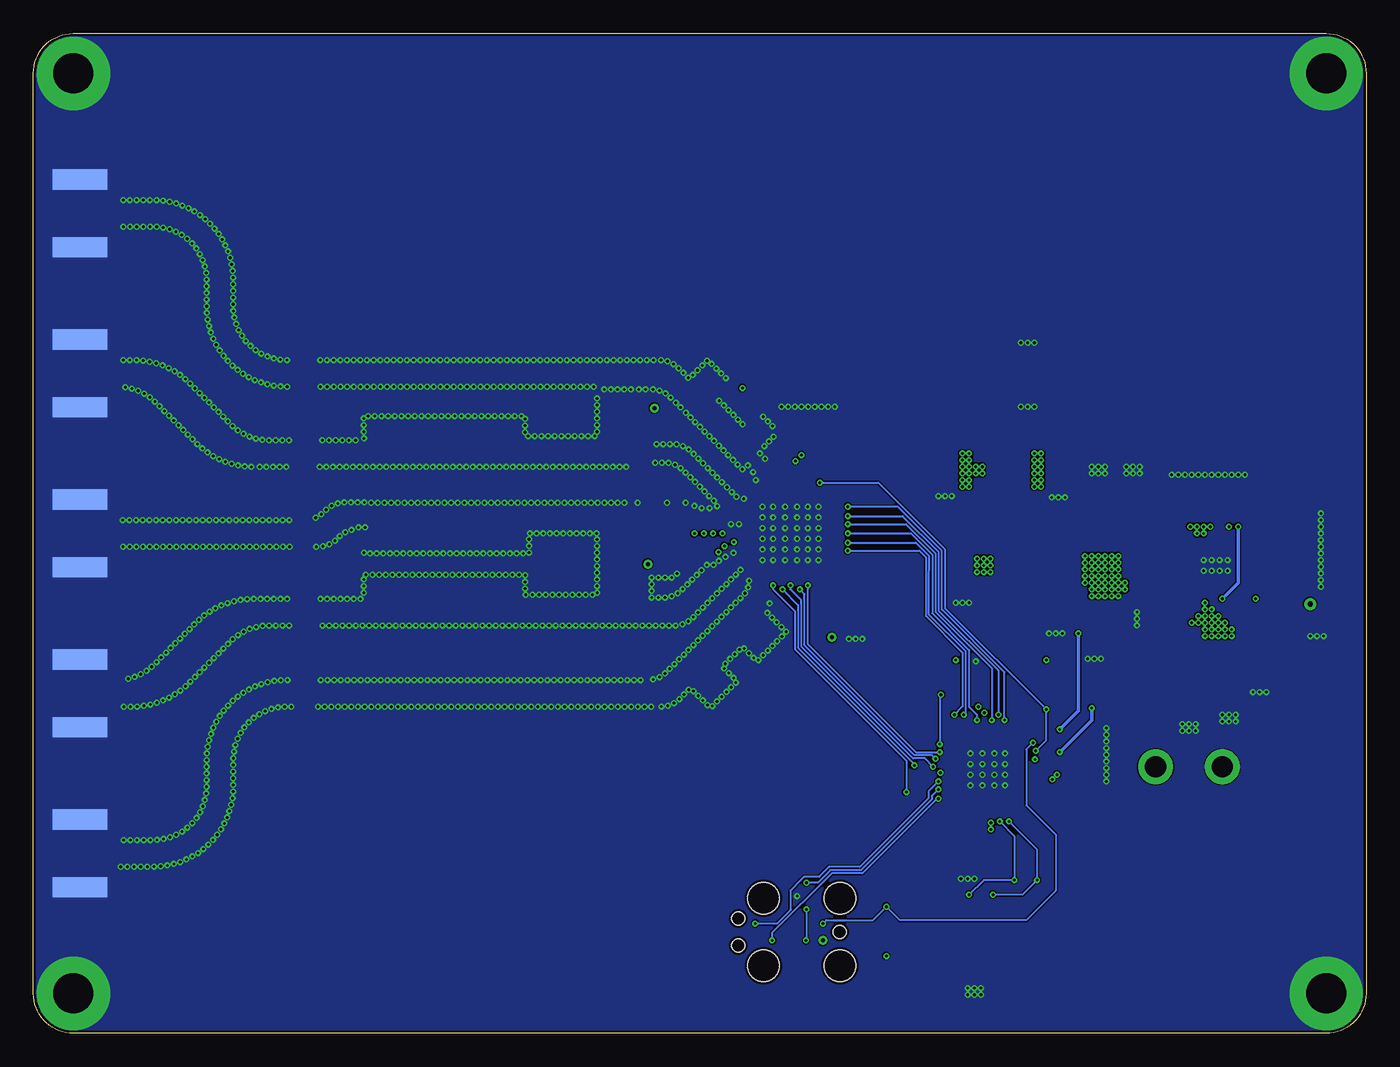
[diagram p9: board, bottom side, seen from below]

Size 100 x 75 mm. Coordinates in mm from the lower left corner, seen from the top.
Outline: 0,3 arc90 3,0 97,0 arc90 100,3 100,72 arc90 97,75 3,75 arc90 0,72 0,3
Copper layers (1+2*15+16): Top 0.035mm / dielectric 0.2mm / Route2 0.0175mm / dielectric 0.665mm / Route15 0.0175mm / dielectric 0.2mm / Bottom 0.035mm
Design rules "jlcpcb_4layer": minimum track width 3.5mil, minimum drill 0.2mm, track to track 3.5mil, track to pad 3.5mil, pad to pad 3.5mil, via to via 5mil, smd to smd 3.5mil, copper to edge 0.2mm, drill to drill 5mil, minimum pad ring 3mil, minimum via ring 3mil, stop-mask expansion 0.075mm, vias tented up to drill 10mm, thermal gap 3.5mil
tRestrict: area 61.6,42.9 to 62.4,44.1; area 58.4,42.9 to 59.2,44.1; area 54.1,43.9 to 55.3,44.7; area 55.8,43.9 to 57,44.7; area 55.2,48.9 to 56,50.1; area 63.8,43.9 to 65,44.7; area 66.4,42.9 to 67.2,44.1; area 66.4,44.5 to 67.2,45.7; area 68.6,43.9 to 69.8,44.7; area 71.2,44.5 to 72,45.7; area 71.2,42.9 to 72,44.1; area 73.4,43.9 to 74.6,44.7; 47 more areas

### Footprints (pad centres in the part's own frame; a part is rotated, then mirrored left to right if it is on the bottom)
CAP0603 = smd 0.889 x 1.016: 1 -0.819,0; 2 0.819,0
CAP1206 = smd 1.27 x 1.778: 1 -1.549,0; 2 1.549,0
SH-03-SIDE = smd 0.6 x 1.55: 1 -1,2.975; 2 0,2.975; 3 1,2.975 | smd 1.2 x 1.8: FIT@1 -2.3,-0.9; FIT@2 2.3,-0.9
2EDG-2P-5MM = drill 1.6 pad 2.6: P$1 -2.5,0; P$2 2.5,0
0603 = smd 0.889 x 1.016: A 0.819,0; C -0.819,0
DO214AC = smd 2.5 x 1.7: A 2,0; C -2,0
1206 = smd 1.7 x 1.803: 1 -1.472,0; 2 1.472,0
IND0603 = smd 0.889 x 1.016: 1 -0.819,0; 2 0.819,0
IND2520 = smd 2.2 x 1.2: 1 0,-1.05; 2 0,1.05
RES0603 = smd 0.889 x 1.016: 1 -0.819,0; 2 0.819,0
U.FL = smd 2.2 x 0.85: P$1 0,1.375; P$2 0,-1.375 | smd 1.05 x 1: P$3 1.525,0; P$4 -1.525,0
SMA-EDGE = smd 1.524 x 4.064: GND@0 -2.54,0; GND@1 2.54,0; SIG 0,0 | smd 1.524 x 4.064 bottom: GND@2 -2.54,0; GND@3 2.54,0
2118730 = smd 3.3 x 1: 1 1.65,0.5; 6 1.65,30.8; 7 43.15,30.8; 8 43.15,0.5 | smd 3.8 x 1: 2 7.4,0.5; 9 13.4,0.5; 10 19.4,0.5; 11 25.4,0.5; 12 31.4,0.5; 13 37.4,0.5; 14 7.4,30.8; 15 13.4,30.8; 17 19.4,30.8; 18 25.4,30.8; 19 31.4,30.8; 20 37.4,30.8 | smd 1 x 2.55: 3 44.3,1.275; 4 0.5,30.025; 5 44.3,30.025; 16 0.5,1.275 | smd 1 x 3.8: 21 0.5,6.65; 22 0.5,12.65; 23 0.5,18.65; 24 0.5,24.65; 25 44.3,6.65; 26 44.3,12.65; 27 44.3,18.65; 28 44.3,24.65
TC2050-IDC = smd 0.787 x 0.787: 1 -2.54,-0.635; 2 -1.27,-0.635; 3 0,-0.635; 4 1.27,-0.635; 5 2.54,-0.635; 6 2.54,0.635; 7 1.27,0.635; 8 0,0.635; 9 -1.27,0.635; 10 -2.54,0.635 | hole 0.991: -3.81,0; 3.81,1.016; 3.81,-1.016 | hole 2.375: -3.81,2.54; -3.81,-2.54; 1.905,2.54; 1.905,-2.54
QFN32_0.5P_TG = smd 0.8 x 0.3: 1 -2.5,1.75; 2 -2.5,1.25; 3 -2.5,0.75; 4 -2.5,0.25; 5 -2.5,-0.25; 6 -2.5,-0.75; 7 -2.5,-1.25; 8 -2.5,-1.75; 17 2.5,-1.75; 18 2.5,-1.25; 19 2.5,-0.75; 20 2.5,-0.25; 21 2.5,0.25; 22 2.5,0.75; 23 2.5,1.25; 24 2.5,1.75 | smd 0.3 x 0.8: 9 -1.75,-2.5; 10 -1.25,-2.5; 11 -0.75,-2.5; 12 -0.25,-2.5; 13 0.25,-2.5; 14 0.75,-2.5; 15 1.25,-2.5; 16 1.75,-2.5; 25 1.75,2.5; 26 1.25,2.5; 27 0.75,2.5; 28 0.25,2.5; 29 -0.25,2.5; 30 -0.75,2.5; 31 -1.25,2.5; 32 -1.75,2.5 | smd 3.8 x 3.8: 33 0,0
TCXO-3225 = smd 0.78 x 0.9: 1 -1.6,-0.7; 2 1.6,-0.7; 3 1.6,0.7; 4 -1.6,0.7
QFN28 = smd 0.75 x 0.3: 1 -2.975,1.95; 2 -2.975,1.3; 3 -2.975,0.65; 4 -2.975,0; 5 -2.975,-0.65; 6 -2.975,-1.3; 7 -2.975,-1.95; 15 2.975,-1.95; 16 2.975,-1.3; 17 2.975,-0.65; 18 2.975,0; 19 2.975,0.65; 20 2.975,1.3; 21 2.975,1.95 | smd 0.3 x 0.75: 8 -1.95,-2.975; 9 -1.3,-2.975; 10 -0.65,-2.975; 11 0,-2.975; 12 0.65,-2.975; 13 1.3,-2.975; 14 1.95,-2.975; 22 1.95,2.975; 23 1.3,2.975; 24 0.65,2.975; 25 0,2.975; 26 -0.65,2.975; 27 -1.3,2.975; 28 -1.95,2.975 | smd 4.8 x 4.8: 29 0,0
SOT23 = smd 1 x 0.55: 1 -1.4,0.95; 2 -1.4,-0.95; 3 1.394,0
QFN20_ASYM_CORNER = smd 0.7 x 0.25: 1 -1.4,1.25; 2 -1.4,0.75; 3 -1.4,0.25; 4 -1.4,-0.25; 5 -1.4,-0.75; 6 -1.4,-1.25; 11 1.4,-1.25; 12 1.4,-0.75; 13 1.4,-0.25; 14 1.4,0.25; 15 1.4,0.75; 16 1.4,1.25 | smd 0.25 x 0.7: 7 -0.75,-1.9; 8 -0.25,-1.9; 9 0.25,-1.9; 10 0.75,-1.9; 17 0.75,1.9; 18 0.25,1.9; 19 -0.25,1.9; 20 -0.75,1.9 | smd 1.65 x 2.65: 21 0,0 | smd 0.375 x 0.375: M1 -1.312,1.812; M2 1.312,1.812; M3 -1.312,-1.812; M4 1.312,-1.812
SOT23-5 = smd 1 x 0.55: 1 -1.4,0.95; 2 -1.4,0; 3 -1.4,-0.95; 4 1.4,-0.95; 5 1.4,0.95

### Placement (x,y rotation side)
C1  28.1,13.5 270 top
C2  29.1,26.2 90 top
C3  21.4,19.4 180 top
C4  29.8,13.5 270 top
C5  46.8,50.2 90 top
C6  40,50.2 90 top
C7  38.2,45 270 top
C8  55.6,46.9 0 top
C9  55.6,35.2 0 top
C10  41.6,45 90 top
C11  52.9,36 90 top
C12  50.4,36.2 0 top
C13  43.3,45 90 top
C14  39.9,45 90 top
C15  38.4,31.5 270 top
C16  56.4,44.3 90 top
C17  56.4,32.4 90 top
C18  56.4,38 270 top
C19  58.8,43.5 0 top
C20  58.8,31.6 0 top
C21  58.8,38.8 0 top
C22  46.3,30.5 225 top
C23  64.4,44.3 90 top
C24  64.4,32.4 90 top
C25  64.3,38 270 top
C26  49.8,48 135 top
C27  66.8,45.1 0 top
C28  49.8,27 225 top
C29  66.8,33.2 0 top
C30  66.7,37.2 0 top
C31  55.6,49.5 0 top
C32  55.6,25.5 0 top
C33  69.2,44.3 90 top
C34  69.2,32.4 90 top
C35  69.1,38 270 top
C36  71.6,45.1 0 top
C37  71.6,33.2 0 top
C38  71.5,37.2 0 top
C39  74,44.3 90 top
C40  74,32.4 90 top
C41  73.9,38 270 top
C42  22.3,38.1 90 top
C43  11.4,39.7 90 top
C44  23.3,31.9 270 top
C45  21.4,21.1 180 top
C46  13.2,39.7 90 top
C47  8,27.5 270 top
C48  9.6,39.7 90 top
C49  6.2,35.8 180 top
C50  30.3,34.2 270 top
C51  21.4,22.8 180 top
C52  32,34.2 270 top
C53  14.7,32.2 180 top
C54  6.2,32.2 0 top
C55  17.5,39.1 90 top
C56  20.1,39.1 90 top
C57  24,38.1 90 top
C58  23.1,42.2 270 top
C59  31.6,42.2 270 top
C60  10.3,26.8 270 top
CON1  29.4,2 0 top
CON2  13.3,20 0 top
D1  25.7,26.2 90 top
D2  3.7,27.9 270 top
D3  13.3,26.8 270 top
F1  16.3,26.8 270 top
L1  40.1,31.5 90 top
L2  52.4,38.8 0 top
L3  54.7,44.3 270 top
L4  54.8,32.4 270 top
L5  54.8,38 90 top
L6  46.3,44.5 135 top
L7  62,43.5 0 top
L8  62,31.6 0 top
L9  61.9,38.8 0 top
L10  48.6,45.7 45 top
L11  48.6,29.3 315 top
L12  66.8,43.5 0 top
L13  66.8,31.6 0 top
L14  66.7,38.8 0 top
L15  71.6,43.5 0 top
L16  71.6,31.6 0 top
L17  71.5,38.8 0 top
L18  16.1,35.2 270 top
LOGO1  67.1,16.2 0 top
LOGO2  20.9,64.7 0 top
R1  36,7.6 270 top
R2  24.7,13.5 90 top
R3  26.4,13.5 90 top
R4  28,8.4 90 top
R5  29.8,8.4 90 top
R6  27.4,26.2 270 top
R7  31.1,49.4 180 top
R8  38.2,50.2 270 top
R9  24,26.2 90 top
R10  30.8,26.2 90 top
R11  18.9,26.2 90 top
R12  20.6,26.2 270 top
R13  21.6,31.9 90 top
R14  19.1,31.1 0 top
R15  6.2,37.6 0 top
R16  6.2,30.4 180 top
R17  6.2,34 0 top
R18  5.4,27.9 90 top
RFCON1  25.4,49.4 0 top
RFCON2  96.5,13.5 90 top
RFCON3  96.5,25.5 90 top
RFCON4  96.5,37.5 90 top
RFCON5  96.5,61.5 90 top
RFCON6  96.5,49.5 90 top
SHIELD1  35.4,21.8 0 top
TC1  43.3,7.6 0 top
U1  28.4,19.8 270 top
U2  43.4,50.2 180 top
U3  43.2,37.5 270 top
U4  25.9,34.2 180 top
U5  11.3,35.1 90 top
U6  27.4,42.2 0 top

### Tracks (layer width: path | path; a pad name or v marks a point on that pad's centre or on a via)
3V3  (via drill 0.2, 0.3)
  Top 0.305: U1.4 v28.65,24.05 v29.1,24.5 C2.1 | U1.14 24.7,19.05 | 24.7,19.05 v23.55,19.05 v23.2,19.4 C3.1 | U1.15 25.2,18.55 24.7,19.05 | 28.15,14.37 v28.15,15.3 v28.15,15.8 U1.20 | U1.28 v31.95,19.55 | U1.11 v24.85,20.55
  Top 0.406: R1.2 v36,5.8 | R10.2 v30.8,28 | R9.2 v24,28
  Top 0.813: R2.2 R3.2 C1.1 28.15,14.37
  other vias: 29.2,35.6 28.7,35.6 28.2,35.6 28.2,35.1 28.2,34.6 28.7,34.6 28.7,35.1 29.2,35.1 29.2,34.6 40.76,6.96
  pour Route15 (rank 5): 40.3,2.4 25.4,2.4 arc-90 22.4,5.4 22.4,28.33 arc-45 23.86,31.86 27.51,35.51 arc-45 28.21,35.8 32,35.8 arc-90 33,34.8 33,23.24 arc45 33.88,21.12 42.42,12.58 arc-45 43.3,10.46 43.3,5.4 arc-90
  pour Top (no thermals): 26.7,35.8 26.7,34.4 33,34.4 33,34.8 arc90 32,35.8
3V3_TRX_CLEAN  (via drill 0.2, 0.3)
  Top 0.305: U3.3 43.85,41.89 v42.82,42.92 v42.37,43.37 41.6,44.14 C10.1 | U3.24 v47.45,36.85 47.85,36.85 v48.15,36.55 v48.6,36.1 49.48,36.1 C12.1
  Top 0.406: C5.1 v46.8,48.4
  Top 0.508: L1.1 v40.1,29.7 | U2.4 46.68,49.5 C5.1
  other vias: 29.3,42 29.3,42.5 28.8,42 28.8,42.5 30.3,41 30.3,41.5 30.3,42 30.3,42.5 30.3,43 29.8,43 29.8,43.5 30.3,43.5 29.8,41 29.8,41.5 29.8,42 29.8,42.5
  pour Route15 (rank 5): 35.8,22.2 80.6,22.2 80.6,52.7 35.8,52.7 29.18,46.08 arc45 28.3,43.96 28.3,40.7 32.8,40.7 arc-90 35.8,37.7
  pour Top (no thermals): 28.3,40.7 30.5,40.7 30.5,42.6 32.1,42.6 32.1,43.7 28.3,43.7
5V0  (via drill 0.2, 0.4)
  Top 0.254: U5.2 10.55,33.15 10,32.6 v8.3,32.6
  Top 0.813: R18.2 5.38,28.74 R16.2 C54.1 v4.2,32.2
  Route15 0.254: v8.3,32.6 7.9,32.2 v4.2,32.2
  Route15 0.813: v4.2,32.2 4.2,38.4 6.9,41.1 15.7,41.1 18.2,38.6
  other vias: 24.9,41 24.9,41.5 24.9,42 24.9,42.5 24.9,43 24.4,43 24.4,43.5 24.9,43.5 24.4,41 24.4,41.5 24.4,42 24.4,42.5 20.1,34.8 19.6,34.8 19.1,34.8 18.6,34.8 21.1,34.3 20.6,34.3 20.1,34.3 19.6,34.3 19.1,34.3 19.1,33.8 18.6,33.8 18.6,34.3 21.1,33.8 20.6,33.8 20.1,33.8 19.6,33.8 20.6,33.3 20.1,33.3 19.6,33.3 19.1,33.3 19.1,32.8 18.6,32.8 18.6,33.3 20.6,32.8 20.1,32.8 19.6,32.8 18.1,33.3 18.1,33.8 20.1,35.8 19.6,35.8 19.1,35.8 18.6,35.8 21.1,35.8 20.6,35.8 20.6,35.3 20.6,34.8 21.1,35.3 20.1,35.3 19.6,35.3 19.1,35.3 18.6,35.3 21.1,34.8
  pour Top (no thermals): 16.6,38.2 16.6,34.1 18.4,32.3 24.12,32.3 24.92,33.1 24.92,37.8 21.5,37.8 21.1,38.2
  pour Top (no thermals): 26.5,43.7 22.6,43.7 22.6,42.6 24.2,42.6 24.2,40.7 26.5,40.7 26.5,41.5 25.2,41.5 25.2,42.9 26.5,42.9
  pour Route15 (rank 5): 18.4,32.3 20.6,32.3 arc90 21.6,33.3 21.6,34.56 arc-45 22.48,36.68 26.5,40.7 26.5,43.7 22.51,43.7 arc45 21.81,43.41 16.6,38.2 16.6,34.1
5V0_BST
  Top 0.254: U5.7 13.65,34.35 13.9,34.1 13.9,32.22 C53.2
5V0_FB
  Top 0.254: U5.20 8.15,34.35 | 8.15,34.35 7.8,34 R17.2 | U5.19 8.65,34.85 8.15,34.35
  Top 0.813: R16.1 C54.2 R17.2
5V0_INTVCC  (via drill 0.2)
  Top 0.254: U5.15 10.55,37.05 v9.6,38 C48.1 | U5.3 11.05,32.85 v10.8,32.6
  Bottom 0.254: v10.8,32.6 9.6,33.8 v9.6,38
5V0_RT
  Top 0.254: U5.17 8.77,35.85 R15.2
5V0_SS
  Top 0.254: U5.18 8.15,35.35 7.7,35.8 C49.1
5V0_SW
  Top 0.61: C53.1 15.52,33.18 15.05,33.65 L18.1
  pour Top (no thermals): 12.98,35.85 12.98,34.85 13.75,34.85 14.4,34.2 15.6,34.2 15.6,36.2 14,36.2 13.65,35.85
5V0_VSENSE  (via drill 0.2)
  Top 0.254: U1.12 24.54,20.05 23.6,20.98 23.6,22.2 v23,22.8 C51.1 | R13.1 v21.6,30
  Top 0.813: R13.1 19.94,31.08 R14.2
  Bottom 0.254: v21.6,30 21.6,24.2 v23,22.8
!LORA_CS  (via drill 0.2)
  Top 0.15: U3.19 43.85,33.35 v43.8,33.3 | U1.32 31.85,21.55 v32,21.7 32.6,21.7 33.9,20.4 v33.9,20.1 | v31.9,25.4 31.88,25.38 R10.1
  Bottom 0.15: v43.8,33.3 42.62,32.12 42.62,28.9 33.9,20.19 v33.9,20.1 | v31.9,25.4 32,25.3 v32,21.7
!LORA_RESET  (via drill 0.2)
  Top 0.127: v24,24.3 R9.1
  Top 0.15: U3.7 41.25,41.05 v41,41.3 | U1.10 24.95,21.05 v24.8,21.2
  Bottom 0.15: v41,41.3 36.6,41.3 31.6,36.3 31.6,31.9 v24,24.3 24,22 v24.8,21.2
!RESET  (via drill 0.2)
  Top 0.127: 25.25,21.55 v25,21.8
  Top 0.15: v36,9.5 R1.1 | U1.9 25.25,21.55
  Bottom 0.127: 35,8.5 v36,9.5
  Bottom 0.15: TC1.10 40.49,8.5 37,8.5 v36,9.5 | v25,21.8 25.5,21.3 25.5,17.1 23.3,14.9 23.3,10.7 25.5,8.5 35,8.5
  other vias: 40.76,8.23
GND  (via drill 0.2, 3 pad 5.5)
  Top 0.254: 11.7,32.9 12.05,33.25 U5.5 12.05,34.35 U5.21 | U5.4 11.55,34.85 U5.21 | U5.21 12.05,35.85 U5.12 12.05,36.97 11.76,37.26 | U5.13 11.55,35.35 U5.21 | U3.29 45.9,34.8 | U3.29 40.5,34.8 | U3.29 40.5,40.2
  Top 0.305: U3.15 41.25,35.55 U3.29 | U3.29 43.85,38.15 U3.26 46.95,38.15 | U3.29 44.5,36.2 U3.23 47,36.2 | U3.29 45.9,40.2
  Top 0.508: U1.33 28.3,19.8 v27.9,20.2 | U6.2 26.9,42.2
  other vias: 97,3 3,72 97,72 3,3 29.7,21 28.8,21 27.9,21 27.1,21 29.7,20.2 28.8,20.2 27.1,20.2 29.7,19.4 28.8,19.4 27.9,19.4 27.1,19.4 29.7,18.6 28.8,18.6 27.9,18.6 27.1,18.6 44.5,35.5 43.6,35.5 42.7,35.5 41.9,35.5 44.5,38.7 43.6,38.7 42.7,38.7 41.9,38.7 44.5,37.9 43.6,37.9 42.7,37.9 41.9,37.9 44.5,37.1 43.6,37.1 42.7,37.1 41.9,37.1 44.5,36.3 43.6,36.3 42.7,36.3 41.9,36.3 44.5,39.5 43.6,39.5 42.7,39.5 41.9,39.5 41.1,35.5 41.1,38.7 41.1,37.9 41.1,37.1 41.1,36.3 41.1,39.5 45.3,35.5 45.3,38.7 45.3,37.9 45.3,37.1 45.3,36.3 45.3,39.5 12.2,35.5 10.4,35.5 11,35.5 11.6,35.5 12.2,34.7 10.4,34.7 11,34.7 11.6,34.7 54.43,26.5 54.93,26.5 55.43,26.5 55.93,26.5 56.43,26.5 56.93,26.5 57.43,26.5 57.93,26.5 58.43,26.5 58.93,26.5 59.43,26.5 59.93,26.5 60.43,26.5 60.93,26.5 61.43,26.5 61.93,26.5 62.43,26.5 62.93,26.5 63.43,26.5 63.93,26.5 64.43,26.5 64.93,26.5 65.43,26.5 65.93,26.5 66.43,26.5 66.93,26.5 67.43,26.5 67.93,26.5 68.43,26.5 68.93,26.5 69.43,26.5 69.93,26.5 70.43,26.5 70.93,26.5 71.43,26.5 71.93,26.5 72.43,26.5 72.93,26.5 73.43,26.5 73.93,26.5 74.43,26.5 74.93,26.5 75.43,26.5 75.93,26.5 76.43,26.5 76.93,26.5 77.43,26.5 77.93,26.5 78.43,26.5 80.93,26.5 81.43,26.48 81.92,26.43 82.41,26.33 82.9,26.19 83.36,26.02 83.81,25.8 84.24,25.55 84.65,25.26 85.04,24.94 85.39,24.59 85.72,24.21 86.01,23.8 86.27,23.37 86.49,22.92 86.67,22.46 86.81,21.98 86.92,21.49 86.98,21 87,20.5 87,20 87,19.5 87,19 87,18.5 87.03,18 87.13,17.51 87.28,17.03 87.49,16.58 87.76,16.16 88.08,15.77 88.44,15.43 88.84,15.13 89.28,14.89 89.74,14.7 90.23,14.58 90.72,14.51 91.22,14.5 91.72,14.5 92.22,14.5 92.72,14.5 93.22,14.5 53.65,24.5 54.15,24.5 54.65,24.5 55.15,24.5 55.65,24.5 56.15,24.5 56.65,24.5 57.15,24.5 57.65,24.5 58.15,24.5 58.65,24.5 59.15,24.5 59.65,24.5 60.15,24.5 60.65,24.5 61.15,24.5 61.65,24.5 62.15,24.5 62.65,24.5 63.15,24.5 63.65,24.5 64.15,24.5 64.65,24.5 65.15,24.5 65.65,24.5 66.15,24.5 66.65,24.5 67.15,24.5 67.65,24.5 68.15,24.5 68.65,24.5 69.15,24.5 69.65,24.5 70.15,24.5 70.65,24.5 71.15,24.5 71.65,24.5 72.15,24.5 72.65,24.5 73.15,24.5 73.65,24.5 74.15,24.5 74.65,24.5 75.15,24.5 75.65,24.5 76.15,24.5 76.65,24.5 77.15,24.5 77.65,24.5 78.15,24.5 78.65,24.5 80.65,24.5 81.15,24.5 81.65,24.45 82.13,24.34 82.6,24.16 83.05,23.94 83.46,23.65 83.83,23.32 84.16,22.95 84.44,22.53 84.67,22.09 84.84,21.62 84.95,21.13 85,20.63 85,20.13 85,19.63 85,19.13 85,18.63 85.01,18.13 85.06,17.64 85.15,17.15 85.29,16.66 85.46,16.2 85.67,15.74 85.92,15.31 86.2,14.9 86.52,14.51 86.87,14.15 87.24,13.82 87.65,13.52 88.07,13.26 88.52,13.04 88.98,12.85 89.46,12.7 89.95,12.59 90.44,12.53 90.94,12.5 91.44,12.5 91.94,12.5 92.44,12.5 92.94,12.5 93.44,12.5 53.47,50.5 53.97,50.5 54.47,50.5 54.97,50.5 55.47,50.5 55.97,50.5 56.47,50.5 56.97,50.5 57.47,50.5 57.97,50.5 58.47,50.5 58.97,50.5 59.47,50.5 59.97,50.5 60.47,50.5 60.97,50.5 61.47,50.5 61.97,50.5 62.47,50.5 62.97,50.5 63.47,50.5 63.97,50.5 64.47,50.5 64.97,50.5 65.47,50.5 65.97,50.5 66.47,50.5 66.97,50.5 67.47,50.5 67.97,50.5 68.47,50.5 68.97,50.5 69.47,50.5 69.97,50.5 70.47,50.5 70.97,50.5 71.47,50.5 71.97,50.5 72.47,50.5 72.97,50.5 73.47,50.5 73.97,50.5 74.47,50.5 74.97,50.5 75.47,50.5 75.97,50.5 76.47,50.5 76.97,50.5 77.47,50.5 77.97,50.5 78.47,50.5 80.97,50.5 81.47,50.53 81.96,50.62 82.44,50.77 82.89,50.98 83.32,51.24 83.7,51.55 84.05,51.91 84.35,52.31 84.6,52.75 84.79,53.21 84.92,53.69 84.99,54.19 85,54.69 85,55.19 85,55.69 85,56.19 85,56.69 85.04,57.18 85.12,57.68 85.24,58.16 85.39,58.64 85.59,59.1 85.83,59.54 86.1,59.96 86.4,60.35 86.74,60.72 87.11,61.06 87.5,61.37 87.92,61.65 88.36,61.89 88.81,62.09 89.29,62.25 89.77,62.37 90.26,62.45 90.76,62.5 91.26,62.5 91.76,62.5 92.26,62.5 92.76,62.5 93.26,62.5 75.46,32.58 75.96,32.58 76.46,32.58 76.96,32.58 77.46,32.58 77.96,32.58 78.46,32.58 80.96,32.58 81.46,32.58 81.96,32.58 82.46,32.58 82.96,32.58 83.46,32.58 83.96,32.57 84.46,32.51 84.95,32.41 85.43,32.27 85.9,32.1 86.35,31.88 86.78,31.63 87.19,31.34 87.57,31.02 87.93,30.67 88.28,30.32 88.64,29.96 88.99,29.61 89.34,29.26 89.7,28.9 90.05,28.55 90.4,28.2 90.76,27.84 91.12,27.5 91.51,27.19 91.94,26.94 92.4,26.74 92.88,26.6 75.82,44.48 76.32,44.48 76.82,44.48 77.32,44.48 77.82,44.48 78.32,44.48 80.82,44.48 81.32,44.48 81.82,44.48 82.32,44.48 82.81,44.51 83.31,44.61 83.78,44.76 84.23,44.97 84.66,45.23 85.05,45.55 85.4,45.9 85.75,46.25 86.11,46.61 86.46,46.96 86.82,47.32 87.17,47.67 87.52,48.02 87.88,48.38 88.23,48.73 88.6,49.07 88.99,49.38 89.41,49.65 89.85,49.89 90.31,50.09 90.78,50.25 91.26,50.37 91.76,50.46 92.25,50.5 92.75,50.5 93.25,50.5 57.95,48.5 58.45,48.5 58.95,48.5 59.45,48.5 59.95,48.5 60.45,48.5 60.95,48.5 61.45,48.5 61.95,48.5 62.45,48.5 62.95,48.5 63.45,48.5 63.95,48.5 64.45,48.5 64.95,48.5 65.45,48.5 65.95,48.5 66.45,48.5 66.95,48.5 67.45,48.5 67.95,48.5 68.45,48.5 68.95,48.5 69.45,48.5 69.95,48.5 70.45,48.5 70.95,48.5 71.45,48.5 71.95,48.5 72.45,48.5 72.95,48.5 73.45,48.5 73.95,48.5 74.45,48.5 74.95,48.5 75.45,48.5 75.95,48.5 76.45,48.5 76.95,48.5 77.45,48.5 77.95,48.5 78.45,48.5 80.95,48.5 81.45,48.52 81.95,48.58 82.44,48.68 82.92,48.82 83.39,49 83.84,49.21 84.27,49.47 84.67,49.76 85.06,50.08 85.41,50.43 85.73,50.81 86.02,51.22 86.28,51.65 86.5,52.1 86.68,52.56 86.82,53.04 86.92,53.53 86.98,54.03 87,54.53 87,55.03 87,55.53 87,56.03 87,56.53 87.04,57.03 87.13,57.52 87.29,57.99 87.5,58.44 87.77,58.86 88.09,59.25 88.46,59.59 88.86,59.88 89.3,60.12 89.77,60.31 90.25,60.43 90.75,60.49 91.25,60.5 91.75,60.5 92.25,60.5 92.75,60.5 93.25,60.5 83.65,42.48 84.14,42.52 84.64,42.6 85.12,42.72 85.6,42.87 86.06,43.07 86.5,43.3 86.93,43.57 87.32,43.87 87.7,44.2 88.05,44.55 88.41,44.91 88.76,45.26 89.11,45.61 89.47,45.97 89.82,46.32 90.17,46.67 90.53,47.03 90.88,47.38 91.26,47.7 91.68,47.98 92.13,48.2 92.6,48.36 93.09,48.46 82.79,30.56 83.29,30.47 83.76,30.33 84.22,30.12 84.65,29.86 85.04,29.55 85.4,29.2 85.75,28.85 86.1,28.5 86.46,28.14 86.81,27.79 87.16,27.44 87.52,27.08 87.87,26.73 88.22,26.38 88.58,26.03 88.97,25.71 89.38,25.43 89.81,25.18 90.27,24.97 90.74,24.79 91.22,24.66 91.71,24.56 92.21,24.51 92.71,24.5 93.21,24.5 93.29,38.5 92.79,38.5 92.29,38.5 91.79,38.5 91.29,38.5 90.79,38.5 90.29,38.5 89.79,38.5 89.29,38.5 88.79,38.5 88.29,38.5 87.79,38.5 87.29,38.5 86.79,38.5 86.29,38.5 85.79,38.5 85.29,38.5 84.79,38.5 84.29,38.5 83.79,38.5 83.29,38.5 82.79,38.5 82.29,38.5 81.79,38.5 81.29,38.5 80.79,38.5 78.82,38.67 78.39,38.93 78.03,39.27 77.62,39.56 77.16,39.75 76.67,39.82 76.17,39.82 75.67,39.82 75.17,39.82 93.27,36.5 92.77,36.5 92.27,36.5 91.77,36.5 91.27,36.5 90.77,36.5 90.27,36.5 89.77,36.5 89.27,36.5 88.77,36.5 88.27,36.5 87.77,36.5 87.27,36.5 86.77,36.5 86.27,36.5 85.77,36.5 85.27,36.5 84.77,36.5 84.27,36.5 83.77,36.5 83.27,36.5 82.77,36.5 82.27,36.5 81.77,36.5 81.27,36.5 80.77,36.5 78.77,36.5 78.27,36.53 77.79,36.68 77.37,36.95 77.01,37.29 76.6,37.58 76.13,37.76 82.3,30.58 81.8,30.58 81.3,30.58 80.8,30.58 78.3,30.58 77.8,30.58 77.3,30.58 76.8,30.58 76.3,30.58 75.8,30.58 75.3,30.58 74.8,30.58 74.3,30.58 73.8,30.58 73.3,30.58 72.8,30.58 72.3,30.58 71.8,30.58 71.3,30.58 70.8,30.58 70.3,30.58 69.8,30.58 69.3,30.58 68.8,30.58 68.3,30.58 67.8,30.58 67.3,30.58 66.8,30.58 66.3,30.58 65.8,30.58 65.3,30.58 64.8,30.58 64.3,30.58 63.8,30.58 63.3,30.58 62.8,30.58 62.3,30.58 61.8,30.58 61.3,30.58 60.8,30.58 60.3,30.58 59.8,30.58 59.3,30.58 58.8,30.58 58.3,30.58 57.8,30.58 57.3,30.58 56.8,30.58 56.3,30.58 55.8,30.58 55.3,30.58 54.8,30.58 54.3,30.58 53.8,30.58 53.3,30.58 52.8,30.58 52.3,30.58 51.8,30.59 51.31,30.69 50.86,30.9 50.48,31.22 50.13,31.57 49.77,31.93 49.42,32.28 49.06,32.64 48.71,32.99 48.36,33.34 48,33.7 47.65,34.05 47.3,34.4 46.94,34.76 75.2,33.04 75.2,33.54 75.2,34.04 75.06,34.4 74.56,34.4 74.06,34.4 73.56,34.4 73.06,34.4 72.56,34.4 72.06,34.4 71.56,34.4 71.06,34.4 70.56,34.4 70.06,34.4 69.56,34.4 69.06,34.4 68.56,34.4 68.06,34.4 67.56,34.4 67.06,34.4 66.56,34.4 66.06,34.4 65.56,34.4 65.06,34.4 64.56,34.4 64.06,34.4 63.56,34.4 63.1,34.36 63.1,33.86 63.1,33.36 63.06,32.9 62.56,32.9 62.06,32.9 61.56,32.9 61.06,32.9 60.56,32.9 60.06,32.9 59.56,32.9 59.06,32.9 58.56,32.9 58.06,32.9 57.7,33.04 57.7,33.54 57.7,34.04 57.7,34.54 57.7,35.04 57.7,35.54 57.7,36.04 57.7,36.54 57.7,37.04 57.74,37.5 58.24,37.5 58.74,37.5 59.24,37.5 59.74,37.5 60.24,37.5 60.74,37.5 61.24,37.5 61.74,37.5 62.24,37.5 62.74,37.5 62.8,37.06 62.8,36.56 62.8,36.06 63.24,36 63.74,36 64.24,36 64.74,36 65.24,36 65.74,36 66.24,36 66.74,36 67.24,36 67.74,36 68.24,36 68.74,36 69.24,36 69.74,36 70.24,36 70.74,36 71.24,36 71.74,36 72.24,36 72.74,36 73.24,36 73.74,36 74.24,36 74.74,36 75.2,36.04 75.1,37.94 75.6,37.94 74.66,39.8 74.16,39.8 73.66,39.8 73.16,39.8 72.66,39.8 72.16,39.8 71.66,39.8 71.16,39.8 70.66,39.8 70.16,39.8 69.66,39.8 69.16,39.8 68.66,39.8 68.16,39.8 67.66,39.8 67.16,39.8 66.66,39.8 66.16,39.8 65.66,39.8 65.16,39.8 64.66,39.8 64.16,39.8 63.66,39.8 63.16,39.8 62.66,39.8 62.16,39.8 61.66,39.8 61.16,39.8 60.66,39.8 60.16,39.8 59.66,39.8 59.16,39.8 58.66,39.8 58.16,39.8 57.66,39.8 57.16,39.8 56.66,39.8 56.16,39.8 55.66,39.8 54.66,39.8 52.46,39.8 51.06,39.8 50.4,39.56 49.26,39.4 49.86,39.4 48.7,39.54 48.94,39.94 49.29,40.29 49.65,40.65 50,41 50.35,41.35 50.71,41.71 51.06,42.06 51.43,42.4 51.86,42.65 52.34,42.78 52.84,42.8 53.34,42.8 55.52,42.48 56.02,42.48 56.52,42.48 57.02,42.48 57.52,42.48 58.02,42.48 58.52,42.48 59.02,42.48 59.52,42.48 60.02,42.48 60.52,42.48 61.02,42.48 61.52,42.48 62.02,42.48 62.52,42.48 63.02,42.48 63.52,42.48 64.02,42.48 64.52,42.48 65.02,42.48 65.52,42.48 66.02,42.48 66.52,42.48 67.02,42.48 67.52,42.48 68.02,42.48 68.52,42.48 69.02,42.48 69.52,42.48 70.02,42.48 70.52,42.48 71.02,42.48 71.52,42.48 72.02,42.48 72.52,42.48 73.02,42.48 73.52,42.48 74.02,42.48 74.52,42.48 75.02,42.48 75.52,42.48 76.02,42.48 76.52,42.48 77.02,42.48 77.52,42.48 78.02,42.48 78.52,42.48 81.02,42.48 81.52,42.48 82.02,42.48 82.52,42.48 83.02,42.48 75.2,44.62 75.2,45.12 75.2,45.62 75.2,46.12 74.88,46.3 74.38,46.3 73.88,46.3 73.38,46.3 72.88,46.3 72.38,46.3 71.88,46.3 71.38,46.3 70.88,46.3 70.38,46.3 69.88,46.3 69.38,46.3 68.88,46.3 68.38,46.3 67.88,46.3 67.38,46.3 66.88,46.3 66.38,46.3 65.88,46.3 65.38,46.3 64.88,46.3 64.38,46.3 63.88,46.3 63.38,46.3 63.1,46.08 63.1,45.58 63.1,45.08 62.88,44.8 62.38,44.8 61.88,44.8 61.38,44.8 60.88,44.8 60.38,44.8 59.88,44.8 59.38,44.8 58.88,44.8 58.38,44.8 57.88,44.8 57.7,45.12 57.7,45.62 57.7,46.12 57.7,46.62 57.7,47.12 57.7,47.62 52.91,50.5 52.42,50.4 51.97,50.19 51.58,49.88 51.23,49.53 50.87,49.17 50.52,49.38 50.16,49.74 49.81,50.09 49.46,50.44 49.1,50.2 48.75,49.85 48.4,49.5 48.04,49.14 53.49,26.55 53.02,26.72 52.61,27 52.25,27.35 51.9,27.7 51.55,28.05 51.19,28.41 50.84,28.76 50.49,29.11 50.13,29.47 49.78,29.82 49.43,30.17 49.07,30.53 48.72,30.88 48.36,31.24 48.01,31.59 47.66,31.94 47.3,32.3 46.95,32.65 46.61,33.01 46.37,33.45 46.3,33.94 52.89,24.5 52.39,24.57 51.93,24.77 51.53,25.07 51.18,25.42 50.83,25.77 50.47,25.67 50.12,25.32 49.77,24.97 49.41,24.61 49.06,24.54 48.71,24.89 48.35,25.25 48,25.6 47.65,25.95 47.29,26.31 47.46,26.66 47.82,27.02 48.17,27.37 48.08,27.72 47.72,28.08 47.37,28.43 47.02,28.78 46.66,28.86 46.31,28.51 45.96,28.16 45.6,28 45.25,28.35 44.9,28.7 44.54,29.06 44.19,29.41 43.83,29.77 43.52,30.12 43.87,30.47 44.23,30.83 44.58,31.18 44.93,31.53 44.76,32.24 51.7,34.48 52.1,34.18 52.6,34.18 53.1,34.18 53.6,34.18 53.6,33.68 53.6,33.18 53.6,32.68 53.1,32.68 52.6,32.69 52.11,32.79 51.66,33 51.28,33.32 50.93,33.67 50.57,34.03 50.22,34.38 49.86,34.74 48.56,35.44 48.96,35.14 49.46,35.14 47.46,36.04 48.06,35.74 46.69,40.09 47.25,40.25 47.6,40.6 47.95,40.95 48.34,41.34 48.69,41.69 49.05,42.05 49.4,42.4 49.75,42.75 50.11,43.11 50.46,43.46 50.83,43.8 51.26,44.05 51.74,44.18 52.24,44.2 52.74,44.2 53.24,44.2 55.17,48.3 55.67,48.3 56.17,48.3 56.67,48.3 57.17,48.3 54.07,48.3 54.57,48.3 53.51,48.3 53.02,48.2 52.57,47.99 52.18,47.68 51.79,47.29 51.44,46.94 51.05,46.55 50.69,46.19 50.34,45.84 49.99,45.49 49.63,45.13 49.28,44.78 48.93,44.43 48.57,44.07 48.22,43.72 47.86,43.36 47.51,43.01 47.16,42.66 46.8,42.3 46.4,42.6 45.8,41.5 46,42.1 45.1,43.1 45.5,43.5 44.45,44.75 44.81,44.39 45.16,44.04 45.25,46.25 44.89,45.89 44.54,45.54 48.55,47.45 48.19,47.09 47.84,46.74 47.49,46.39 47.13,46.03 46.78,45.68 38.8,29.58 38.3,29.58 37.8,29.58 39.87,47 40.37,47 40.87,47 41.37,47 41.87,47 42.37,47 42.87,47 43.37,47 43.87,47 47.06,38.2 47.66,38.2 7.5,25.6 8,25.6 8.5,25.6 12.8,22.7 13.3,22.7 13.8,22.7 12.8,23.2 13.3,23.2 13.8,23.2 9.8,23.4 10.3,23.4 10.8,23.4 9.8,23.9 10.3,23.9 10.8,23.9 3.4,38 3.4,38.5 3.4,39 3.4,36.5 3.4,37 3.4,37.5 3.4,35 3.4,35.5 3.4,36 3.4,33.5 3.4,34 3.4,34.5 3.2,29.8 3.7,29.8 4.2,29.8 13.6,41.9 14.1,41.9 14.6,41.9 12.1,41.9 12.6,41.9 13.1,41.9 10.6,41.9 11.1,41.9 11.6,41.9 9.1,41.9 9.6,41.9 10.1,41.9 19.6,42.5 20.1,42.5 20.6,42.5 19.6,42 20.1,42 20.6,42 17,42 17.5,42 18,42 17,42.5 17.5,42.5 18,42.5 22.6,40.2 23.1,40.2 23.6,40.2 31.1,40.3 31.6,40.3 32.1,40.3 29.8,32.3 30.3,32.3 30.8,32.3 29.3,27.9 19.5,21.9 19.5,22.4 19.5,22.9 19.5,20.4 19.5,20.9 19.5,21.4 19.5,18.9 19.5,19.4 19.5,19.9 19.9,28.1 20.4,28.1 20.9,28.1 17.2,30.6 17.2,31.1 17.2,31.6 22.8,30 23.3,30 23.8,30 29.4,11.6 29.9,11.6 30.4,11.6 28.9,3.4 29.4,3.4 29.9,3.4 28.9,2.9 29.4,2.9 29.9,2.9 24.9,51.8 25.4,51.8 25.9,51.8 24.9,47 25.4,47 25.9,47 42.7,10.3
  pour Top (rank 6): -2,77 102,77 102,-2 -2,-2
  pour Bottom (rank 6): -5,80 105,80 105,-5 -5,-5
  pour Top (no thermals): 99,57.7 94,57.7 94,65.3 99,65.3
  pour Bottom (no thermals): 99,57.7 94,57.7 94,65.3 99,65.3
  pour Route15 (rank 6): -4,79 104,79 104,-4 -4,-4
  pour Route2 (rank 6): -3,78 103,78 103,-3 -3,-3
  pour Bottom (no thermals): 99,45.7 94,45.7 94,53.3 99,53.3
  pour Top (no thermals): 99,45.7 94,45.7 94,53.3 99,53.3
  pour Top (no thermals): 99,33.7 94,33.7 94,41.3 99,41.3
  pour Bottom (no thermals): 99,33.7 94,33.7 94,41.3 99,41.3
  pour Top (no thermals): 99,21.7 94,21.7 94,29.3 99,29.3
  pour Bottom (no thermals): 99,21.7 94,21.7 94,29.3 99,29.3
  pour Top (no thermals): 99,9.7 94,9.7 94,17.3 99,17.3
  pour Bottom (no thermals): 99,9.7 94,9.7 94,17.3 99,17.3
I2C0_SCL  (via drill 0.2)
  Top 0.15: U1.19 27.65,16.05 v27.5,15.9 | v26.4,11.5 R3.1 | v29.8,10.4 R5.2
  Bottom 0.15: v27.5,15.9 26.4,14.8 v26.4,11.5 28.7,11.5 v29.8,10.4
I2C0_SDA  (via drill 0.2)
  Top 0.15: U1.18 27.15,16.25 v26.8,15.9 | v24.7,11.5 R2.1 | v28,10.4 R4.2
  Bottom 0.15: v26.8,15.9 24.7,13.8 v24.7,11.5 25.8,10.4 v28,10.4
LED
  Top 0.254: U1.8 26.65,23.75 27.4,24.5 R6.2
LORA_!RX!/TX  (via drill 0.2)
  Top 0.15: U3.20 v44.5,33.6 | v34.5,18.1 32.4,16 30.8,16 30.15,16.65 U1.24
  Bottom 0.15: v44.5,33.6 44.5,33.3 42.86,31.66 42.86,28.8 34.5,20.45 v34.5,18.1
LORA_DIO0  (via drill 0.2)
  Top 0.15: U1.7 27.15,23.48 v27.13,23.5 | v38.9,39.5 38.95,39.45 U3.8
  Bottom 0.15: v27.13,23.5 27.13,27.09 31.84,31.8 31.84,36.2 35.14,39.5 v38.9,39.5
LORA_DIO1  (via drill 0.2)
  Top 0.15: U3.9 v38.9,38.8 | U1.6 27.65,23.85 v27.6,23.9
  Bottom 0.15: v38.9,38.8 34.78,38.8 32.08,36.1 32.08,31.7 27.6,27.22 v27.6,23.9
LORA_DIO2  (via drill 0.2)
  Top 0.15: U1.5 28.15,23.45 v28.1,23.5 | v38.9,38.2 38.95,38.15 U3.10
  Bottom 0.15: v38.9,38.2 34.51,38.2 32.32,36 32.32,31.6 28.1,27.39 v28.1,23.5
LORA_DIO3  (via drill 0.2)
  Top 0.127: 29.15,23.45 U1.3
  Top 0.15: U3.11 v38.9,37.5 | v29.2,23.5 29.15,23.45
  Bottom 0.15: v38.9,37.5 34.15,37.5 32.56,35.9 32.56,31.5 29.8,28.75 29.8,24.5 29.2,23.9 v29.2,23.5
LORA_DIO4  (via drill 0.2)
  Top 0.15: U3.12 38.95,36.85 v38.9,36.8 | U1.2 29.65,23.35 v30.2,23.9
  Bottom 0.15: v38.9,36.8 33.79,36.8 32.79,35.8 32.79,35 32.79,34.7 32.79,31.41 30.04,28.65 30.04,24.06 v30.2,23.9
LORA_DIO5  (via drill 0.2)
  Top 0.15: U3.13 v38.9,36.2 | U1.1 30.15,23.15 v30.9,23.9
  Bottom 0.15: v38.9,36.2 33.53,36.2 33.03,35.71 33.03,31.31 30.28,28.55 30.28,24.52 v30.9,23.9
LORA_TRX_VR_ANA
  Top 0.305: U3.2 44.5,42.1 43.3,43.3 C13.1
LORA_TRX_VR_DIG
  Top 0.305: U3.4 43.2,41.79 41.79,43.2 40.88,43.2 C14.1
LORA_TRX_VR_PA  (via drill 0.2, 0.3)
  Top 0.305: v49,37.5 v49.7,37.5 v50.4,37.5 | U3.25 v48.3,37.5 48.6,37.5
  Top 0.312: L3.1 54.7,46.82 C8.1 | L5.1 54.78,37.16 C9.1 54.78,33.24 L4.1 | 48.6,37.5 v49,37.5
  Top 0.61: C8.1 v53.4,46.9 | C9.1 v53.9,35.2 53.88,35.18 C11.1
  pour Route15: 48.1,42.5 48.1,37.5 50.7,34.9 54.2,34.9 55.5,36.2 55.5,45.4 53.6,47.3 52.9,47.3
N$1
  Top 0.305: C15.1 38.4,34.8 39.15,35.55 U3.14
  Top 0.813: C15.1 L1.2
N$2
  Top 0.312: U3.28 46.72,39.45 arc45 48.14,40.04 50.99,42.9 arc-45 52.41,43.48 L3.2 C16.1 56.42,43.5 C19.1
N$3
  Top 0.312: L7.1 C19.2
N$4
  Top 0.508: CON1.2 29.4,7.18 R5.1
N$5
  Top 0.312: C27.1 L12.1 65.96,43.48 C23.1 64.38,43.5 L7.2
N$6
  Top 0.305: C4.1 29.8,15 28.65,16.15 U1.21
N$7
  Top 0.312: C36.1 L15.1 70.76,43.48 C33.1 67.64,43.48 L12.2 C27.2
N$8
  Top 0.312: U3.21 45.15,33.64 arc45 45.74,32.22 C22.1 48.02,29.94 L11.1
N$9
  Top 0.312: U3.1 45.15,41.36 arc-45 45.74,42.78 L6.1 48.02,45.06 L10.1
N$10
  Top 0.312: L10.2 49.24,46.28 C26.1 51.87,48.91 arc-45 53.29,49.5 C31.1
N$11
  Top 0.312: U3.22 46.72,35.55 arc-45 48.14,34.96 50.93,32.17 arc45 52.35,31.58 L4.2 C17.1 56.42,31.6 C20.1
N$12
  Top 0.312: C20.2 L8.1
N$13
  Top 0.312: L8.2 64.38,31.6 C24.1 65.96,31.58 L13.1 C29.1
N$14
  Top 0.312: C29.2 L13.2 67.64,31.58 C34.1 70.76,31.58 L16.1 C37.1
N$15
  Top 0.312: C37.2 L16.2 72.44,31.58 C40.1 82.95,31.58 arc-45 86.48,30.12 89.64,26.96 arc45 93.17,25.5 RFCON3.SIG
N$16
  Top 0.312: L11.2 49.24,28.72 C28.1 51.87,26.09 arc45 53.29,25.5 C32.1
N$17
  Top 0.312: U3.27 L2.1
N$18
  Top 0.312: L2.2 53.24,38.82 L5.2 C18.1 57.96,38.82 C21.1
N$19
  Top 1.27: F1.2 16.3,20.5 CON2.P$2
N$20
  Top 0.312: C36.2 L15.2 72.44,43.48 C39.1 82.91,43.48 arc45 86.44,44.95 89.54,48.04 arc-45 93.07,49.5 RFCON6.SIG
N$21
  Top 0.312: C21.2 L9.1
N$22
  Top 0.312: L9.2 62.74,38.82 C25.1 65.86,38.82 L14.1 C30.1
N$23
  Top 0.312: C30.2 L14.2 69.08,38.8 C35.1 70.66,38.82 L17.1 C38.1
N$24
  Top 0.312: C38.2 L17.2 73.88,38.8 C41.1 75.65,38.82 arc-45 77.07,38.23 77.21,38.09 arc45 78.63,37.5 RFCON4.SIG 96.48,37.52
N$25
  Top 0.813: D1.A R6.1
N$26
  Top 0.312: C31.2 81,49.5 arc90 86,54.5 86,56.5 arc-90 91,61.5 RFCON5.SIG
N$27
  Top 0.312: C32.2 81,25.5 arc-90 86,20.5 86,18.5 arc90 91,13.5 RFCON2.SIG
N$28
  Top 0.254: U3.5 42.55,40.95 arc90 41.3,42.2 39.45,42.2 arc-90 38.2,43.45 C7.2
N$29
  Top 0.312: RFCON1.P$3 R7.2
N$38
  Top 0.508: R4.1 28.4,7.18 CON1.1
N$149
  Top 0.813: D2.A R18.1
PLL_REF_DCC
  Top 0.254: C7.1 R8.2 C6.1 40.12,49.5 U2.3
  Top 0.312: R7.1 38.18,49.4 R8.2
SPI_MISO  (via drill 0.2)
  Top 0.15: U1.30 32.27,20.55 v32.31,20.59 | v42.5,33.3 42.55,33.35 U3.17
  Bottom 0.15: v32.31,20.59 32.58,20.86 33.9,20.86 42.14,29.1 42.14,32.94 v42.5,33.3
SPI_MOSI  (via drill 0.2)
  Top 0.15: U3.18 v43.2,33.6 | U1.29 32.45,20.05 v32.5,20
  Bottom 0.15: v32.5,20 33.12,20.62 34,20.62 42.38,29 42.38,32.48 43.2,33.3 v43.2,33.6
SPI_SCK  (via drill 0.2)
  Top 0.15: U3.16 v41.9,33.6 | U1.31 31.95,21.05 v32,21.1
  Bottom 0.15: v32,21.1 33.8,21.1 41.9,29.2 v41.9,33.6
SWCLK  (via drill 0.2)
  Top 0.15: U1.25 31.65,18.05 v32.1,17.6
  Bottom 0.15: v32.1,17.6 32.2,17.6 37.8,12 40.1,12 44.57,7.53 TC1.4
  other vias: 44.57,6.96
SWDIO  (via drill 0.2)
  Top 0.15: U1.26 31.85,18.55 v32.1,18.3 | v42,11.3 v42,9.3
  Bottom 0.127: 42,7 TC1.2
  Bottom 0.15: v42,9.3 42,7 | v32.1,18.3 32.27,18.13 32.28,18.13 32.6,17.8 32.6,17.54 37.9,12.24 40.2,12.24 41.14,11.3 v42,11.3
  other vias: 42.03,6.96
SWO  (via drill 0.2)
  Top 0.15: U1.27 31.95,19.05 v32.1,18.9
  Bottom 0.15: v32.1,18.9 32.27,18.73 32.28,18.73 32.84,18.16 32.84,17.64 38,12.48 40.3,12.48 41.05,11.73 42.18,11.73 42.43,11.48 42.43,11.47 43.2,10.7 43.2,9.24 44.2,8.23 TC1.6
  other vias: 45.84,8.23
VIN  (via drill 0.2)
  Top 0.15: U5.14 11.05,37.25 v10.3,38
  Top 0.813: R11.2 17.65,28.27 F1.1 | C47.1 10.27,28.32 C60.1
  other vias: 11.7,38 12.2,38 12.7,38 13.2,38 12.7,37.5 12.2,37.5 11.6,30.3 11.1,30.3 10.6,30.3 10.1,30.3 13.1,30.8 12.1,29.8 11.6,29.8 11.1,29.8 10.6,29.8 10.1,29.8 11.6,31.3 11.1,31.3 11.6,31.8 12.1,32.3 12.6,31.3 12.1,31.3 12.1,30.8 12.1,30.3 12.6,30.8 11.6,30.8 11.1,30.8 10.6,30.8 12.1,31.8
  pour Top (no thermals): 9.4,27.4 9.4,30 12.55,33.15 12.55,33.9 12.55,33.9 12.55,31.75 14,30.3 16.2,30.3 17.3,29.2 17.3,27.4
  pour Route15: 9.4,27.4 9.4,38.5 arc-90 10.2,39.3 13.7,39.3 13.7,28.4 arc-90 12.7,27.4
  pour Top (no thermals): 13.7,39.3 10.9,39.3 10.9,38.6 12.55,36.95 12.55,36.3 12.55,36.3 12.55,36.85 13.7,38
VIN_VSENSE  (via drill 0.2)
  Top 0.254: U1.13 24.55,19.55 v23,21.1 C45.1 | R12.2 v20.6,24.4
  Top 0.813: R11.1 R12.2
  Bottom 0.254: v20.6,24.4 20.6,23.5 v23,21.1

### Text on the board
tPlace: B2 + B3 / IN | B1 (Band 1) - 862 MHz to 1020 MHz / B2 (Band 2) - 410 MHz to 525 MHz / B3 (Band 3) - 137 MHz to 175 MHz / / PA BOOST - All bands | B2 + B3 / OUT | REF / IN | PA / BOOST | B1 / OUT | B1 / IN | DC IN / Max. 24 V | - | + | IcyRadio LoRa Transceiver v1 / Mar 2021